# EAGLE board tc08 (EAGLE 6.6.0), part 1 of 10
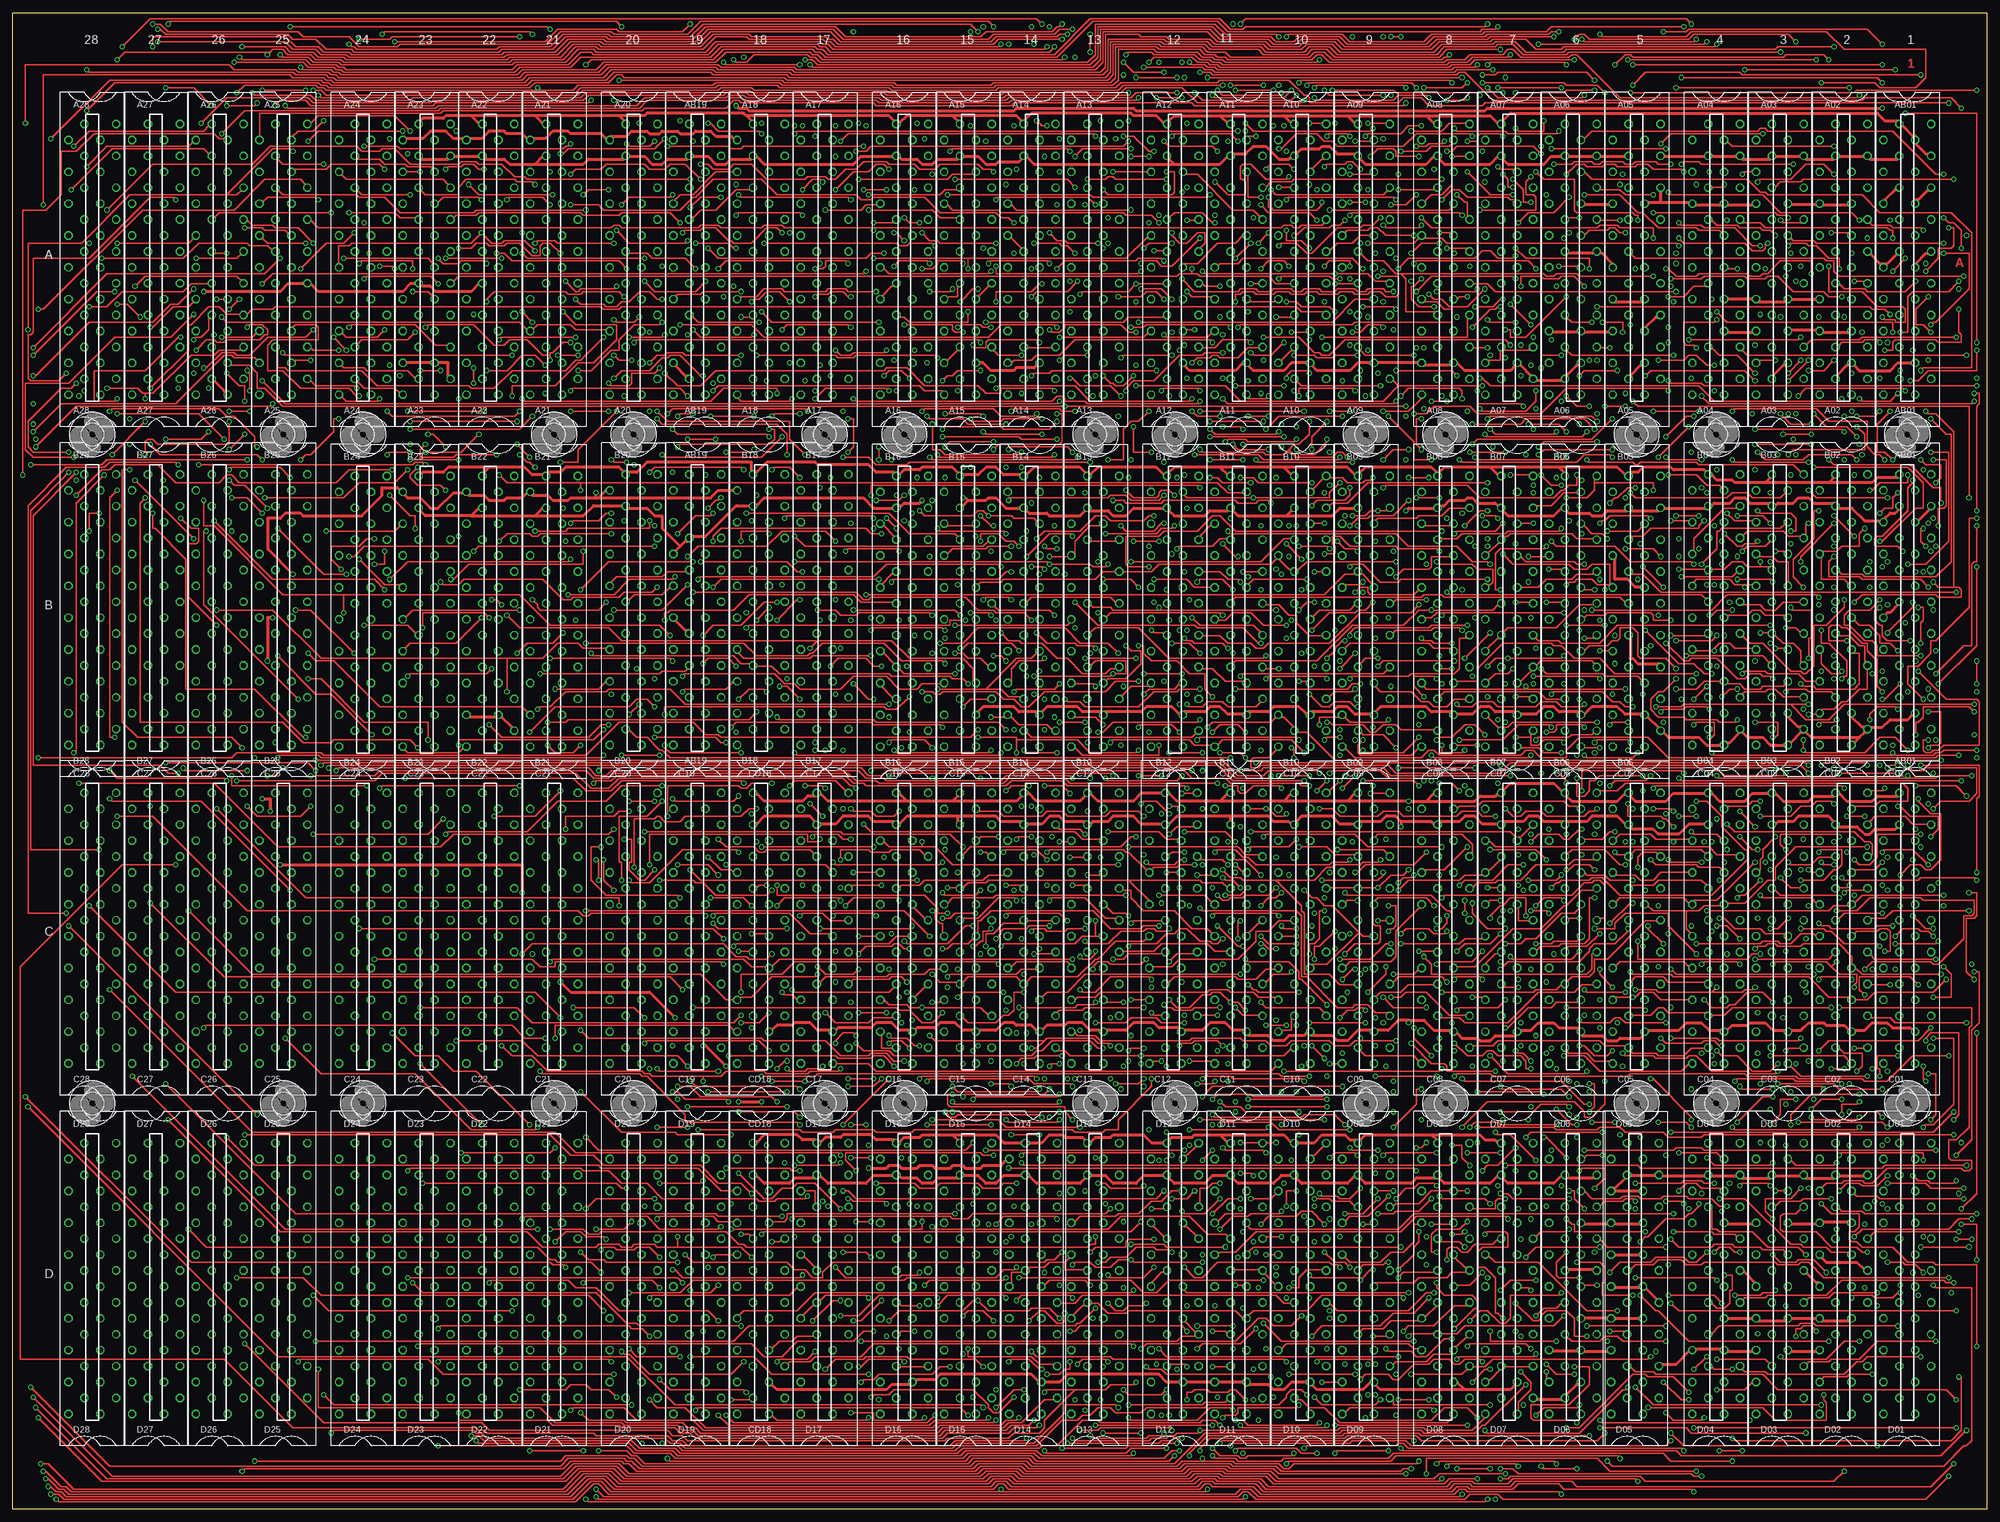
[diagram p12: board, top side]
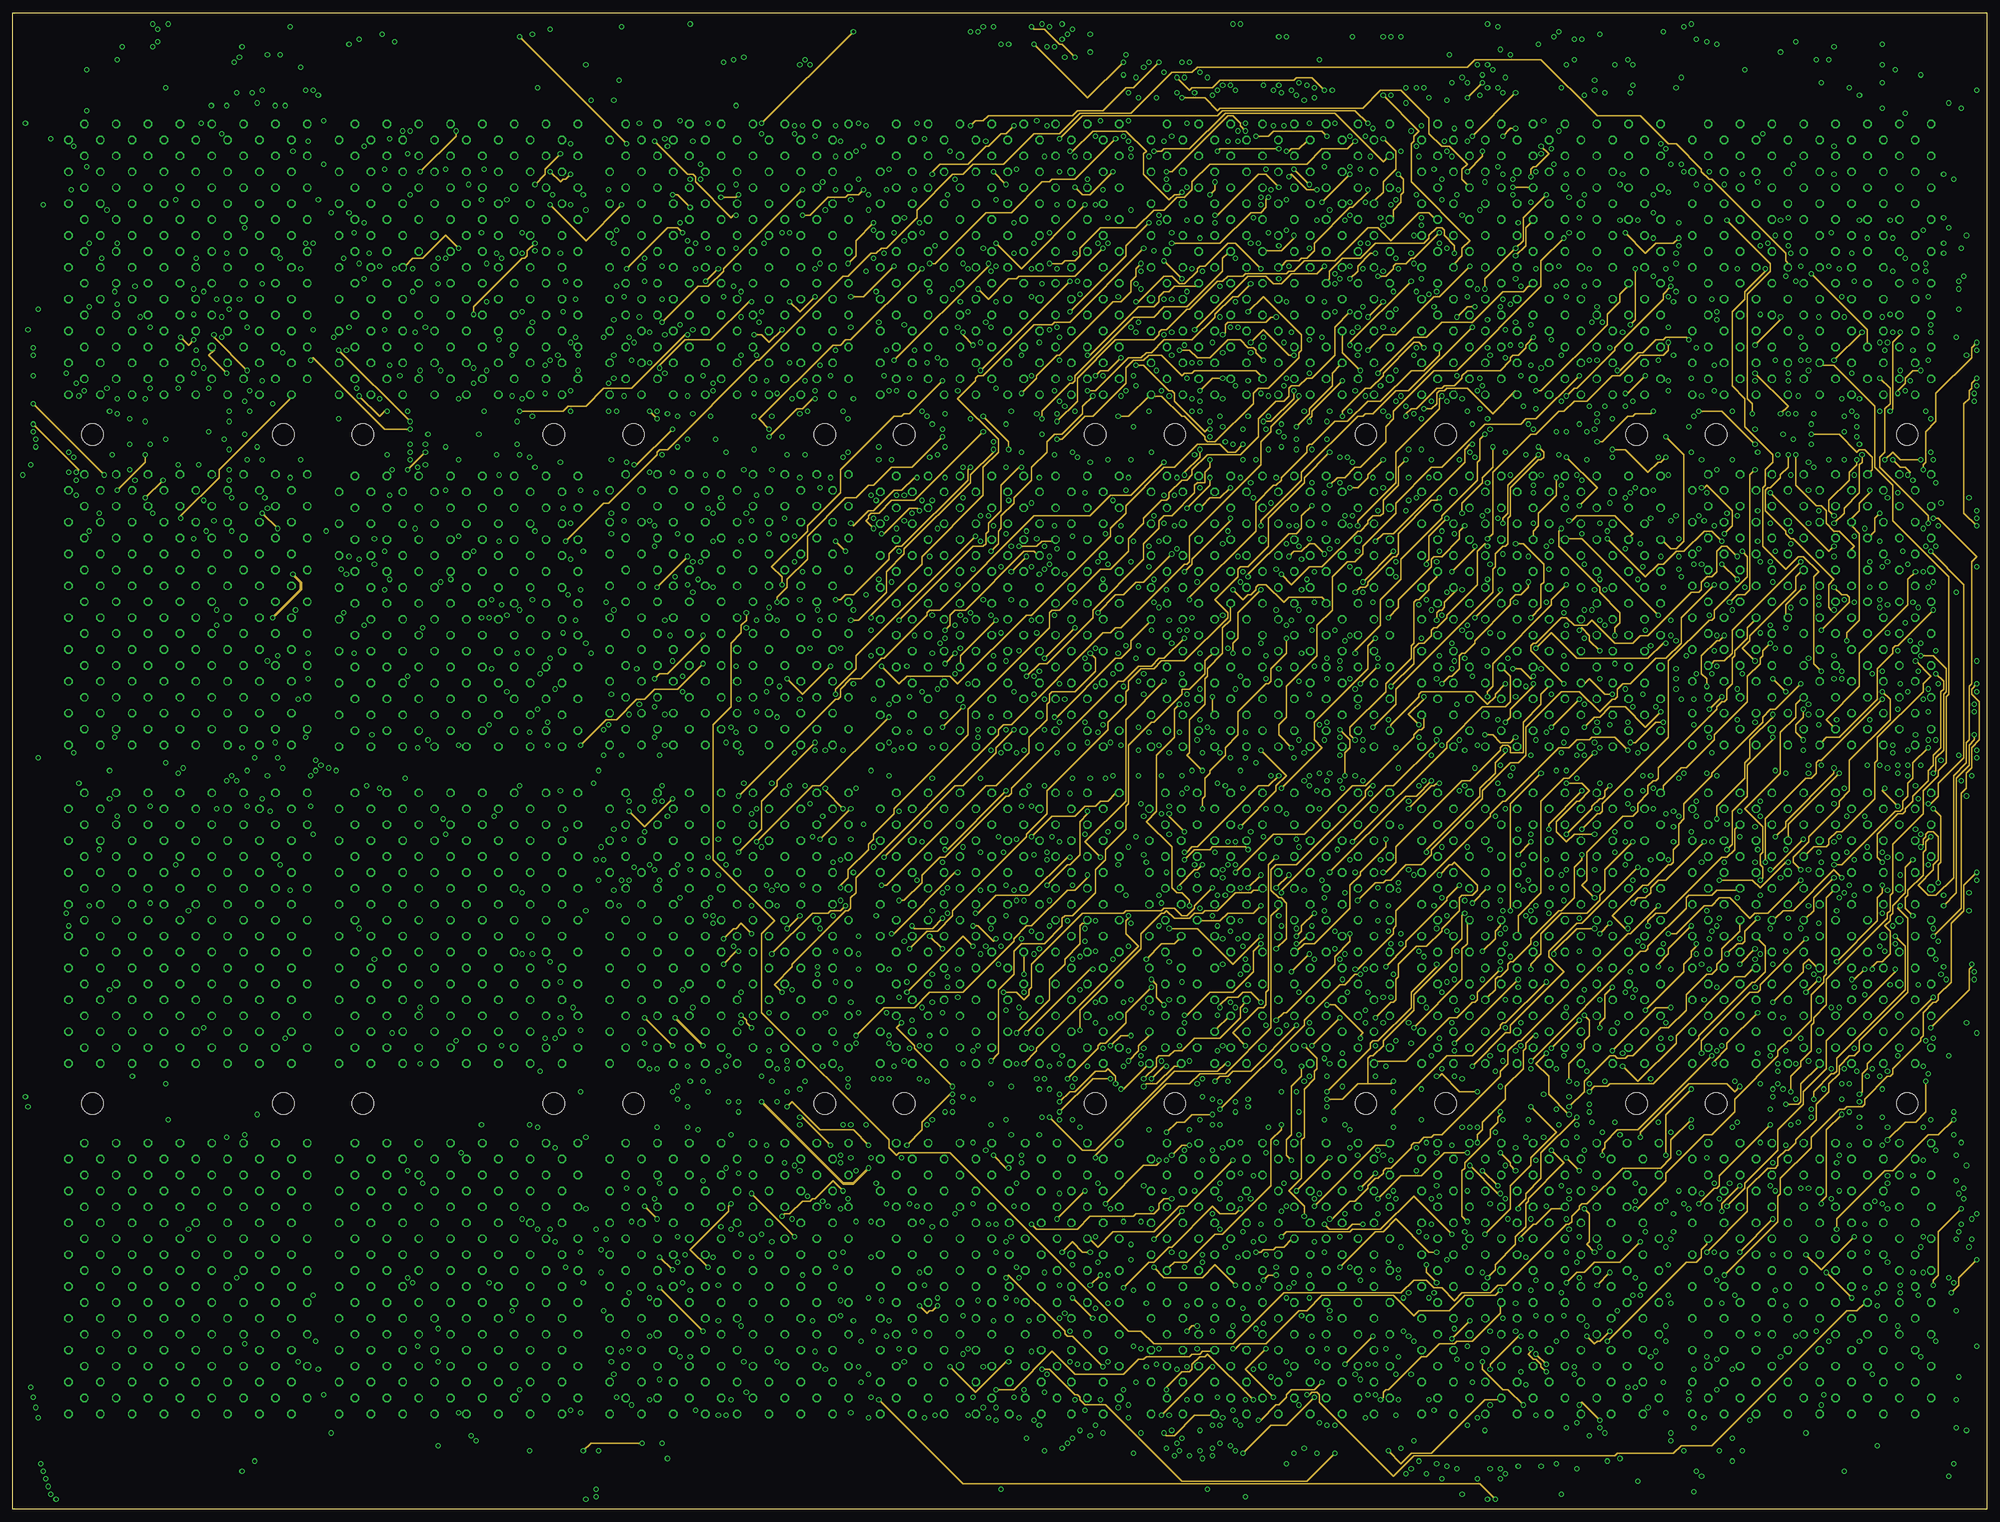
[diagram p13: board, inner layer Route2]
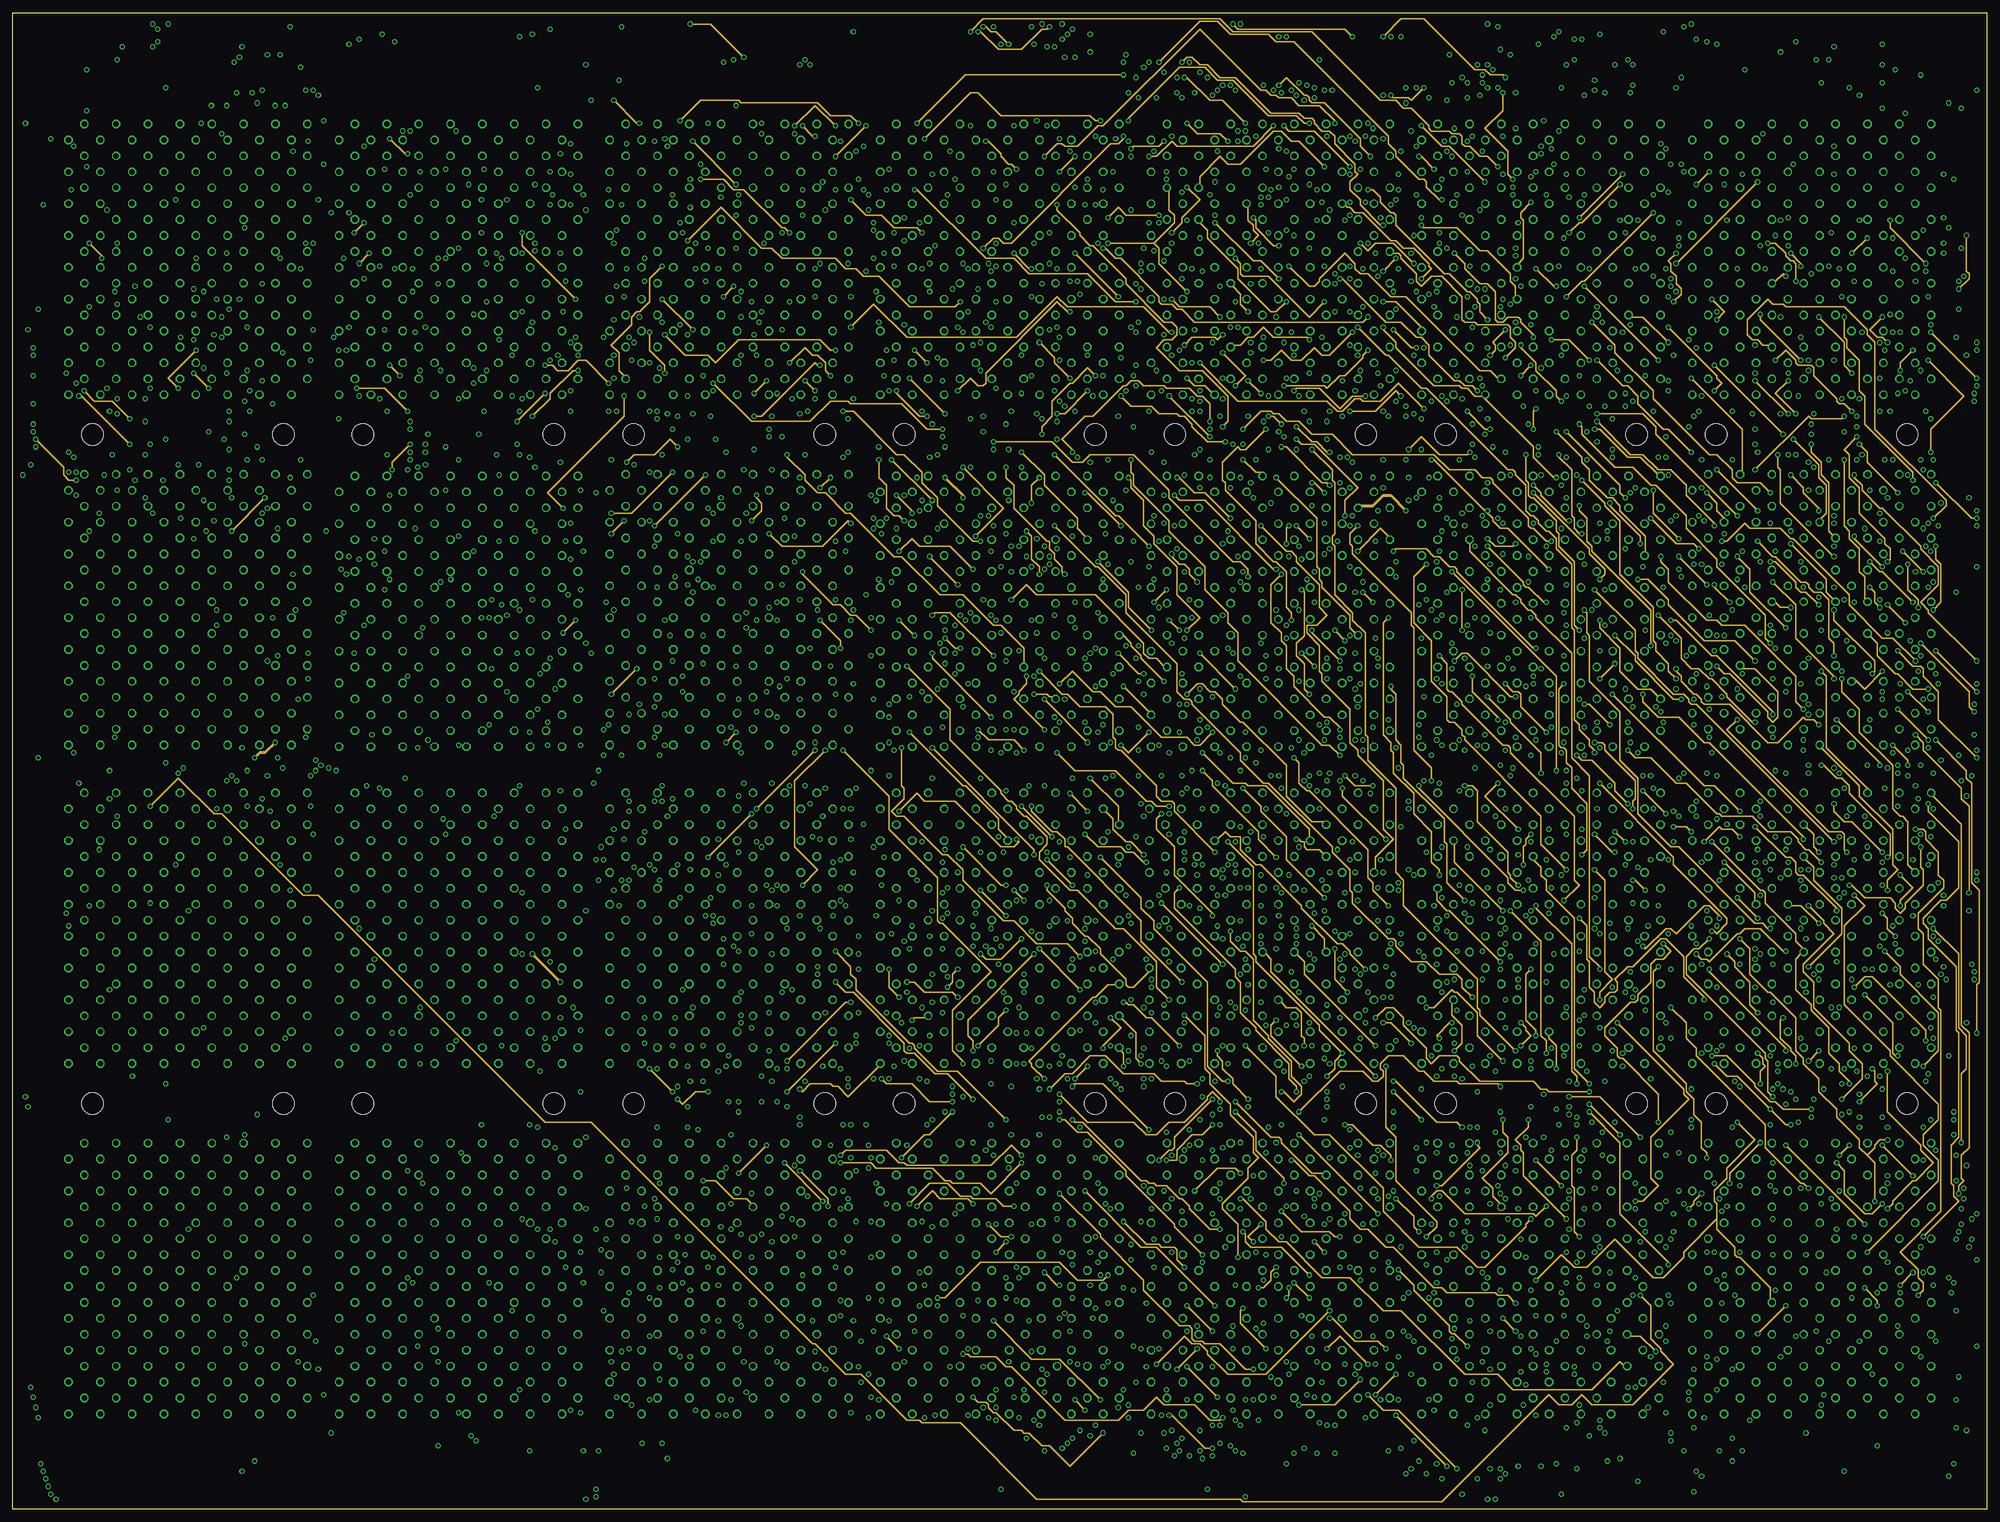
[diagram p14: board, inner layer Route15]
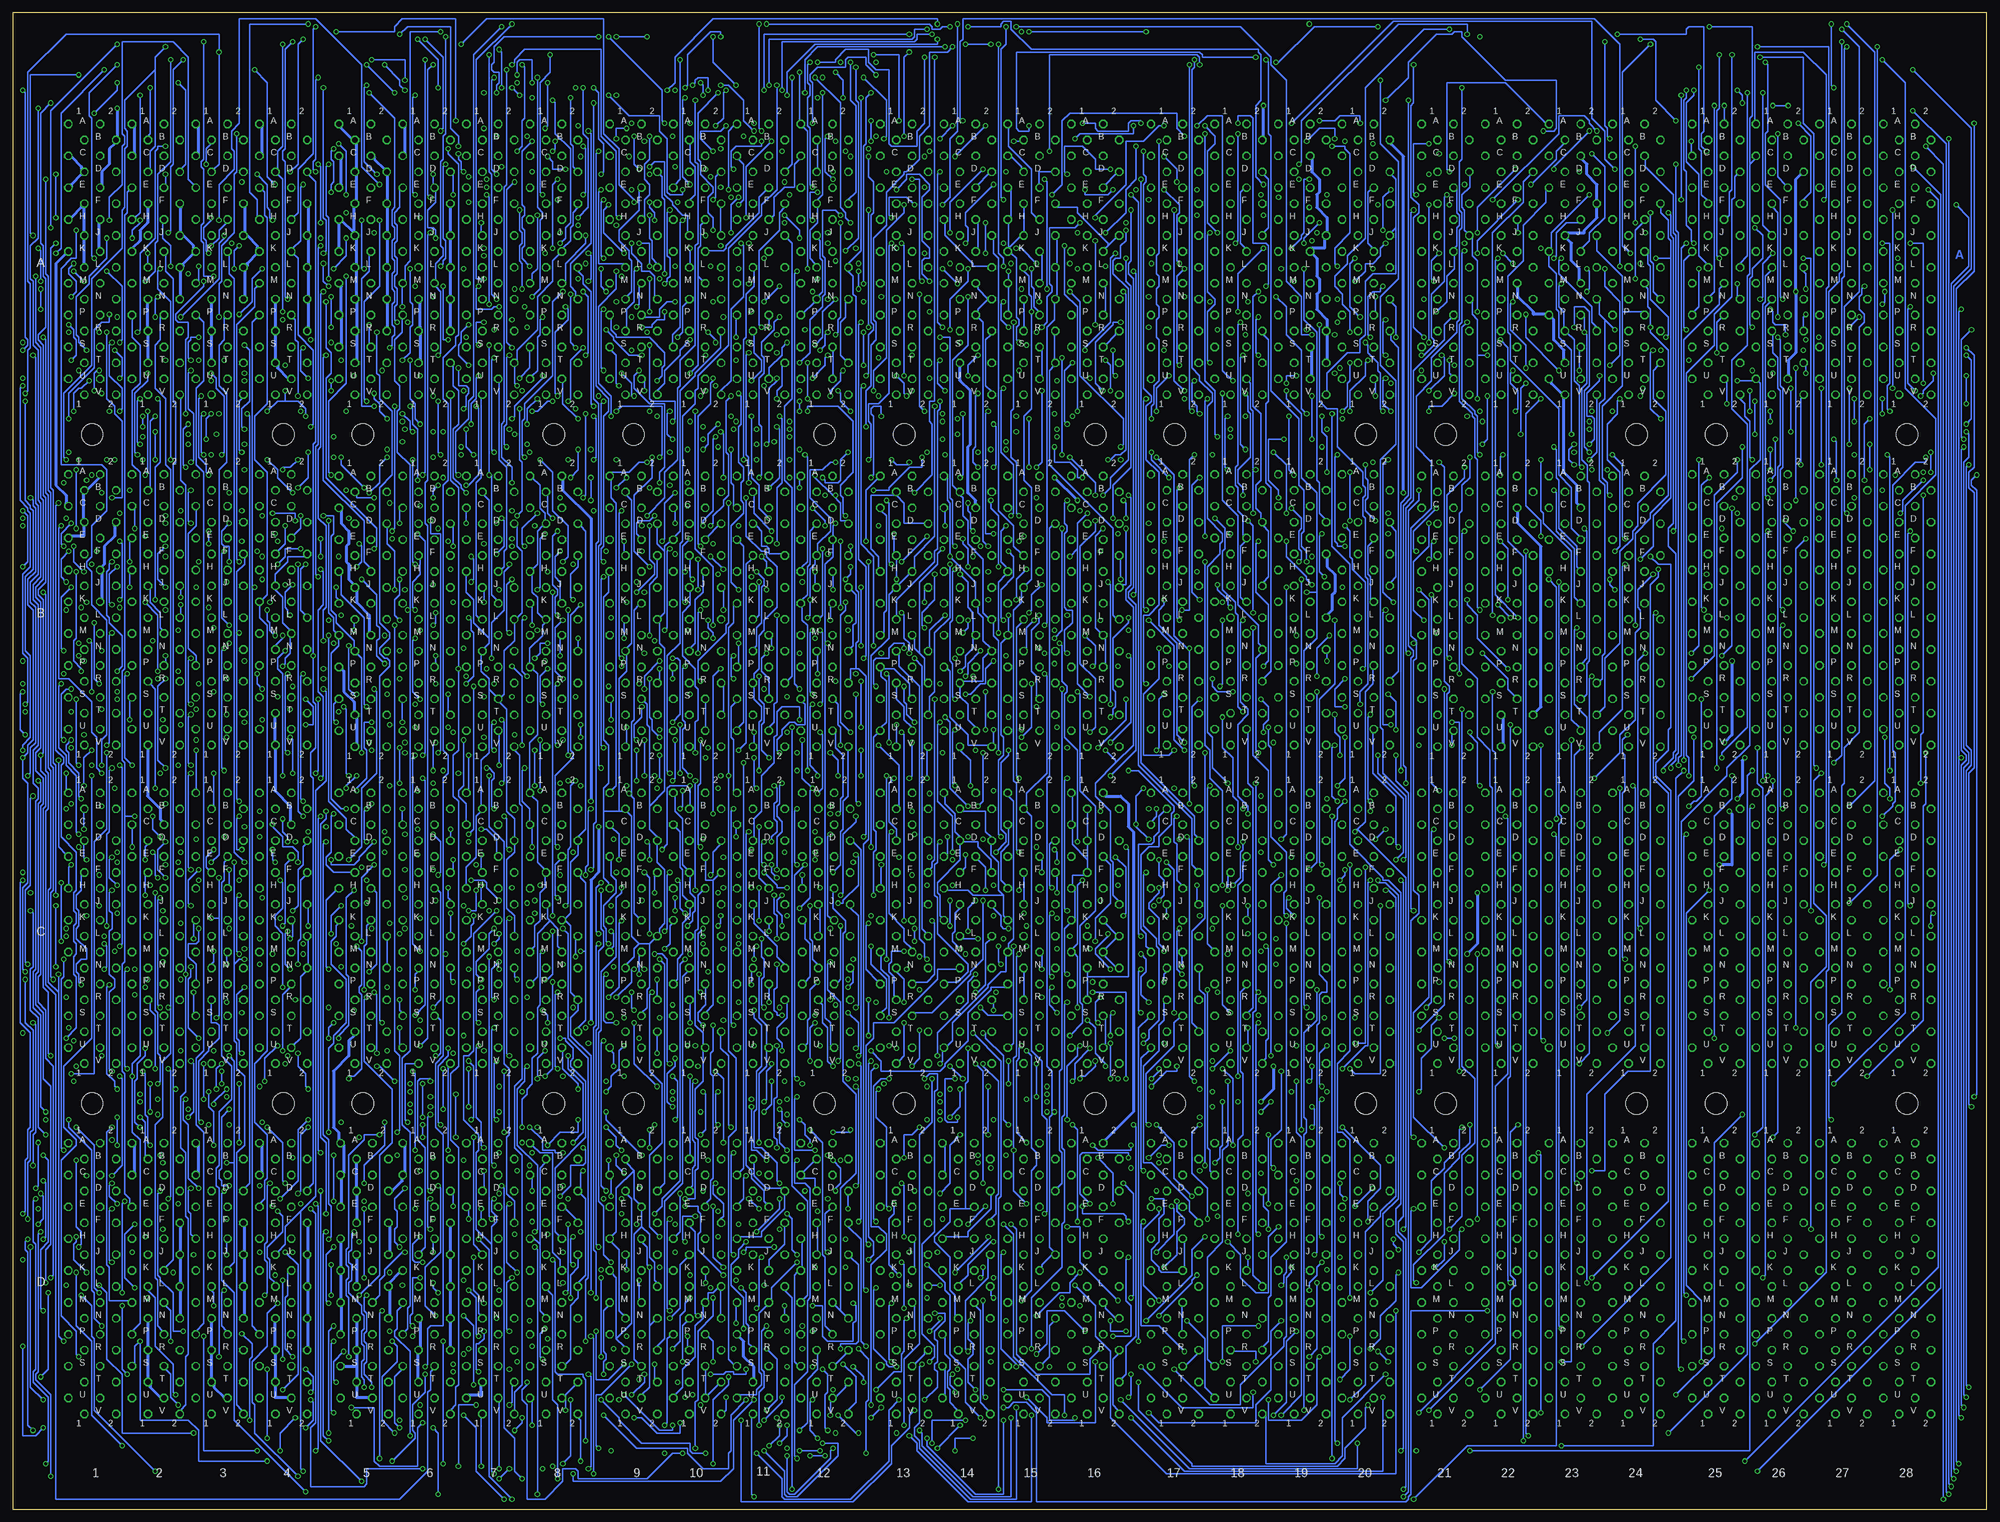
[diagram p15: board, bottom side, seen from below]

Size 393.76 x 298.44 mm. Coordinates in mm from the lower left corner, seen from the top.
Outline: 393.73,0 0,0 0.03,298.42 393.76,298.44 393.73,0
Copper layers (1*2*15*16): Top 0.035mm / dielectric 1.5mm / Route2 0.035mm / dielectric 0.15mm / Route15 0.035mm / dielectric 0.2mm / Bottom 0.035mm
Design rules "10mils": minimum track width 10mil, minimum drill 24mil, track to track 10mil, track to pad 10mil, pad to pad 10mil, via to via 10mil, smd to smd 10mil, copper to edge 40mil, drill to drill 10mil, minimum pad ring 10mil, minimum via ring 8mil, stop-mask expansion 0mil, vias tented up to drill 0mil, thermal gap 10mil
Net classes: 1 Power: width 0.635 mm, drill 0.381 mm, clearance 0.381 mm

## Footprints (pad centres in the part's own frame; a part is rotated, then mirrored left to right if it is on the bottom)
H807 = drill 1.092 octagon: A1 4.763,28.575; A2 -1.587,28.575; B1 1.587,25.4; B2 -4.763,25.4; C1 4.763,22.225; C2 -1.587,22.225; D1 1.587,19.05; D2 -4.763,19.05; E1 4.763,15.875; E2 -1.587,15.875; F1 1.587,12.7; F2 -4.763,12.7; H1 4.763,9.525; H2 -1.587,9.525; J1 1.587,6.35; J2 -4.763,6.35; K1 4.763,3.175; K2 -1.587,3.175; L1 1.587,0; L2 -4.763,0; M1 4.763,-3.175; M2 -1.587,-3.175; N1 1.587,-6.35; N2 -4.763,-6.35; P1 4.763,-9.525; P2 -1.587,-9.525; R1 1.587,-12.7; R2 -4.763,-12.7; S1 4.763,-15.875; S2 -1.587,-15.875; T1 1.587,-19.05; T2 -4.763,-19.05; U1 4.763,-22.225; U2 -1.587,-22.225; V1 1.587,-25.4; V2 -4.763,-25.4
H807-2 = drill 1.092 octagon: AA1 4.763,60.325; AA2 -1.587,60.325; AB1 1.587,57.15; AB2 -4.763,57.15; AC1 4.763,53.975; AC2 -1.587,53.975; AD1 1.587,50.8; AD2 -4.763,50.8; AE1 4.763,47.625; AE2 -1.587,47.625; AF1 1.587,44.45; AF2 -4.763,44.45; AH1 4.763,41.275; AH2 -1.587,41.275; AJ1 1.587,38.1; AJ2 -4.763,38.1; AK1 4.763,34.925; AK2 -1.587,34.925; AL1 1.587,31.75; AL2 -4.763,31.75; AM1 4.763,28.575; AM2 -1.587,28.575; AN1 1.587,25.4; AN2 -4.763,25.4; AP1 4.763,22.225; AP2 -1.587,22.225; AR1 1.587,19.05; AR2 -4.763,19.05; AS1 4.763,15.875; AS2 -1.587,15.875; AT1 1.587,12.7; AT2 -4.763,12.7; AU1 4.763,9.525; AU2 -1.587,9.525; AV1 1.587,6.35; AV2 -4.763,6.35; BA1 4.763,-9.525; BA2 -1.587,-9.525; BB1 1.587,-12.7; BB2 -4.763,-12.7; BC1 4.763,-15.875; BC2 -1.587,-15.875; BD1 1.587,-19.05; BD2 -4.763,-19.05; BE1 4.763,-22.225; BE2 -1.587,-22.225; BF1 1.587,-25.4; BF2 -4.763,-25.4; BH1 4.763,-28.575; BH2 -1.587,-28.575; BJ1 1.587,-31.75; BJ2 -4.763,-31.75; BK1 4.763,-34.925; BK2 -1.587,-34.925; BL1 1.587,-38.1; BL2 -4.763,-38.1; BM1 4.763,-41.275; BM2 -1.587,-41.275; BN1 1.587,-44.45; BN2 -4.763,-44.45; BP1 4.763,-47.625; BP2 -1.587,-47.625; BR1 1.587,-50.8; BR2 -4.763,-50.8; BS1 4.763,-53.975; BS2 -1.587,-53.975; BT1 1.587,-57.15; BT2 -4.763,-57.15; BU1 4.763,-60.325; BU2 -1.587,-60.325; BV1 1.587,-63.5; BV2 -4.763,-63.5
4,3 = hole 4.3: 0,0

## Placement (x,y rotation side)
A02  M903  [H807]  365.16,247.64 0 top
A03  M903  [H807]  352.46,247.64 0 top
A04  M903  [H807]  339.76,247.64 0 top
A05  M903  [H807]  323.89,247.64 0 top
A06  M903  [H807]  311.19,247.64 0 top
A07  M161  [H807]  298.49,247.64 0 top
A08  M206  [H807]  285.79,247.64 0 top
A09  M117  [H807]  269.91,247.64 0 top
A10  M113  [H807]  257.21,247.64 0 top
A11  M111  [H807]  244.51,247.64 0 top
A12  M113  [H807]  231.81,247.64 0 top
A13  H807  [H807]  215.94,247.64 0 top
A14  M302  [H807]  203.24,247.64 0 top
A15  M627  [H807]  190.54,247.64 0 top
A16  M602  [H807]  177.84,247.64 0 top
A17  H807  [H807]  161.96,247.64 0 top
A18  G888  [H807]  149.26,247.64 0 top
A20  G888  [H807]  123.86,247.64 0 top
A21  G888  [H807]  107.99,247.64 0 top
A22  M502  [H807]  95.29,247.64 0 top
A23  M633  [H807]  82.59,247.64 0 top
A24  W023  [H807]  69.89,247.64 0 top
A25  M916  [H807]  54.01,247.64 0 top
A26  M916  [H807]  41.31,247.64 0 top
A27  H807  [H807]  28.61,247.64 0 top
A28  H807  [H807]  15.91,247.64 0 top
AB01  G821  [H807-2]  377.86,215.89 0 top
AB19  W032  [H807-2]  136.56,215.89 0 top
B02  M623  [H807]  365.16,177.79 0 top
B03  M623  [H807]  352.46,177.79 0 top
B04  M623  [H807]  339.76,177.79 0 top
B05  M623  [H807]  323.89,177.47 0 top
B06  M111  [H807]  311.19,177.47 0 top
B07  M207  [H807]  298.49,177.47 0 top
B08  M113  [H807]  285.79,177.47 0 top
B09  M206  [H807]  269.91,177.47 0 top
B10  M627  [H807]  257.21,177.47 0 top
B11  M115  [H807]  244.51,177.47 0 top
B12  M117  [H807]  231.81,177.47 0 top
B13  M206  [H807]  215.94,177.47 0 top
B14  M206  [H807]  203.24,177.47 0 top
B15  M113  [H807]  190.54,177.47 0 top
B16  M602  [H807]  177.84,177.47 0 top
B17  H807  [H807]  161.96,177.79 0 top
B18  G888  [H807]  149.26,177.79 0 top
B20  G888  [H807]  123.86,177.79 0 top
B21  G879  [H807]  107.99,177.47 0 top
B22  M633  [H807]  95.29,177.47 0 top
B23  W005  [H807]  82.59,177.47 0 top
B24  H807  [H807]  69.89,177.47 0 top
B25  H807  [H807]  54.01,177.79 0 top
B26  H807  [H807]  41.31,177.79 0 top
B27  H807  [H807]  28.61,177.79 0 top
B28  H807  [H807]  15.91,177.79 0 top
C01  M101  [H807]  377.86,114.29 0 top
C02  M101  [H807]  365.16,114.29 0 top
C03  M101  [H807]  352.46,114.29 0 top
C04  M103  [H807]  339.76,114.29 0 top
C05  M103  [H807]  323.89,114.29 0 top
C06  M111  [H807]  311.19,114.29 0 top
C07  M207  [H807]  298.49,114.29 0 top
C08  M121  [H807]  285.79,114.29 0 top
C09  M206  [H807]  269.91,114.29 0 top
C10  M121  [H807]  257.21,114.29 0 top
C11  M113  [H807]  244.51,114.29 0 top
C12  M115  [H807]  231.49,114.29 0 top
C13  M111  [H807]  215.94,114.29 0 top
C14  M206  [H807]  203.24,114.29 0 top
C15  M113  [H807]  190.54,114.29 0 top
C16  M627  [H807]  177.84,114.29 0 top
C17  M111  [H807]  161.96,114.29 0 top
C19  H807  [H807]  136.56,114.29 0 top
C20  H807  [H807]  123.86,114.29 0 top
C21  H807  [H807]  107.99,114.29 0 top
C22  H807  [H807]  95.29,114.29 0 top
C23  H807  [H807]  82.59,114.29 0 top
C24  H807  [H807]  69.89,114.29 0 top
C25  H807  [H807]  54.01,114.29 0 top
C26  H807  [H807]  41.31,114.29 0 top
C27  H807  [H807]  28.61,114.29 0 top
C28  H807  [H807]  15.91,114.29 0 top
CD18  M228  [H807-2]  149.26,82.54 0 top
D01  H807  [H807]  377.86,44.44 0 top
D02  M903  [H807]  365.16,44.44 0 top
D03  M903  [H807]  352.46,44.44 0 top
D04  M903  [H807]  339.76,44.44 0 top
D05  M903  [H807]  323.57,44.44 0 top
D06  M903  [H807]  311.19,44.44 0 top
D07  M161  [H807]  298.49,44.44 0 top
D08  M207  [H807]  285.79,44.44 0 top
D09  M121  [H807]  269.91,44.44 0 top
D10  M119  [H807]  257.21,44.44 0 top
D11  M206  [H807]  244.51,44.44 0 top
D12  M627  [H807]  231.81,44.44 0 top
D13  M602  [H807]  215.94,44.44 0 top
D14  M307  [H807]  203.55,44.44 0 top
D15  M401  [H807]  190.54,44.44 0 top
D16  M302  [H807]  177.84,44.44 0 top
D17  M602  [H807]  161.96,44.44 0 top
D19  H807  [H807]  136.56,44.44 0 top
D20  H807  [H807]  123.86,44.44 0 top
D21  H807  [H807]  107.99,44.44 0 top
D22  H807  [H807]  95.29,44.44 0 top
D23  H807  [H807]  82.59,44.44 0 top
D24  H807  [H807]  69.89,44.44 0 top
D25  H807  [H807]  54.01,44.44 0 top
D26  H807  [H807]  41.31,44.44 0 top
D27  H807  [H807]  28.61,44.44 0 top
D28  H807  [H807]  15.91,44.44 0 top
U$17  [4,3]  54.01,214.3 0 top
U$18  [4,3]  69.89,214.3 0 top
U$19  [4,3]  107.99,214.3 0 top
U$20  [4,3]  123.86,214.3 0 top
U$66  [4,3]  161.96,214.3 0 top
U$67  [4,3]  177.84,214.3 0 top
U$68  [4,3]  215.94,214.3 0 top
U$69  [4,3]  231.81,214.3 0 top
U$70  [4,3]  269.91,214.3 0 top
U$71  [4,3]  285.79,214.3 0 top
U$72  [4,3]  323.89,214.3 0 top
U$73  [4,3]  339.76,214.3 0 top
U$74  [4,3]  377.86,214.3 0 top
U$75  [4,3]  377.86,80.95 0 top
U$76  [4,3]  339.76,80.95 0 top
U$77  [4,3]  323.89,80.95 0 top
U$78  [4,3]  285.79,80.95 0 top
U$79  [4,3]  269.91,80.95 0 top
U$80  [4,3]  231.81,80.95 0 top
U$81  [4,3]  215.94,80.95 0 top
U$82  [4,3]  177.84,80.95 0 top
U$83  [4,3]  161.96,80.95 0 top
U$84  [4,3]  107.99,80.95 0 top
U$85  [4,3]  69.89,80.95 0 top
U$86  [4,3]  123.86,80.95 0 top
U$87  [4,3]  54.01,80.95 0 top
U$88  [4,3]  15.91,80.95 0 top
U$90  [4,3]  15.91,214.3 0 top

## Tracks (layer width: path | path; a pad name or v marks a point on that pad's centre or on a via)
0_TO_DTB  (via drill 0.61)
  Top 0.254: v225.59,85.84 224.57,84.82 v220,84.82 | v208.82,81.27 208.32,80.76 188,80.76 v187.49,81.27 | v173.26,85.84 171.74,84.32 v166.66,84.32 | v161.58,88.38 161.07,87.87 158.53,87.87 158.02,87.36 154.98,87.36 v154.47,87.87 | v150.91,91.43 148.88,93.46 126.53,93.46 v126.02,92.95 | v123.99,128 123.99,137.66 128.05,137.66 128.56,138.16 129.07,138.16 130.08,137.15 133.13,137.15 134.15,138.16 145.32,138.16 146.85,139.69 v148.37,139.69 | v195.62,211.32 196.63,212.33 208.82,212.33 209.33,212.84 209.33,218.43 v208.32,218.43 | v246.92,244.34 248.96,244.34 A11.M1
  Route2 0.254: v225.59,85.84 228.13,88.38 228.13,89.9 228.64,90.41 230.67,90.41 231.68,91.43 233.21,91.43 235.75,93.97 240.83,93.97 244.89,98.03 244.89,100.06 245.91,101.08 C11.R1 | v220,84.82 220,86.35 218.48,87.87 217.97,87.36 215.94,87.36 211.87,83.3 210.86,83.3 v208.82,81.27 | v167.17,177.28 168.69,177.28 174.28,182.87 174.28,186.93 177.84,190.49 177.84,191.5 191.04,204.71 191.04,206.24 195.62,210.81 v195.62,211.32 | v214.41,223 215.94,223 222.54,229.6 225.08,229.6 226.1,230.62 227.11,230.62 229.65,233.16 235.24,233.16 239.81,237.73 239.81,238.24 243.37,241.8 244.38,241.8 v246.92,244.34
  Route15 0.254: v187.49,81.27 182.92,81.27 179.36,84.82 174.28,84.82 v173.26,85.84 | v148.37,139.69 v160.06,151.37 | v208.32,218.43 209.84,218.43 v214.41,223
  Bottom 0.254: v166.66,84.32 163.61,87.36 161.58,87.36 v161.58,88.38 | v154.47,87.87 v150.91,91.43 | v126.02,92.95 123.99,92.95 v123.99,128 | v160.06,151.37 162.09,153.4 162.09,172.2 v167.17,177.28
0_TO_EF
  Bottom 0.254: A11.E2 243.37,263.13 244.89,261.61 244.89,258.56 251.5,251.96 251.5,251.45 252,250.94 255.05,250.94 A10.K2
0_TO_STA
  Top 0.254: A11.N1 246.42,240.78 252,240.78 A10.N2
1_TO_DF  (via drill 0.61)
  Top 0.254: v238.29,4.05 237.78,3.54 197.65,3.54 | 197.65,3.54 v197.14,4.05 | v215.43,107.68 215.43,108.19 216.44,109.21 218.48,109.21 218.98,108.7 225.08,108.7 v226.1,109.72 | v288.07,262.12 289.6,260.59 290.1,260.59 290.1,257.54 A08.H1 | v286.55,290.06 286.04,289.55 285.53,289.55 285.02,289.04 263.18,289.04 261.66,290.56 259.62,290.56 258.61,289.55 242.86,289.55 241.84,290.56 238.29,290.56 237.27,291.58 229.14,291.58 228.64,292.09 219.49,292.09 219.49,285.99 218.48,284.98 154.47,284.98 153.96,285.48 121.96,285.48 121.45,285.99 120.43,285.99 118.91,284.47 104.18,284.47 103.16,283.45 63.03,283.45 62.52,283.96 61.5,283.96 61,284.47 20.36,284.47 v14.77,278.88 | v7.66,3.04 9.18,3.04 10.2,2.02 111.8,2.02 115.35,5.58 117.38,5.58 119.42,3.54 197.65,3.54
  Route2 0.254: v202.22,94.98 214.92,107.68 v215.43,107.68 | v226.1,109.72 229.14,112.76 231.68,112.76 232.7,113.78 C12.L1
  Bottom 0.254: v238.29,4.05 238.29,42.15 239.81,43.68 D11.L2 | v197.14,4.05 197.14,61.96 196.63,62.47 196.63,89.4 v202.22,94.98 | C12.J1 232.7,119.88 232.7,114.8 C12.L1 | v288.07,262.12 288.58,262.62 288.58,284.47 286.55,286.5 v286.55,290.06 | v14.77,278.88 8.16,272.28 8.16,3.54 v7.66,3.04
1_TO_DTF  (via drill 0.61)
  Top 0.254: v239.3,28.44 242.35,28.44 D11.S2 | v217.46,15.23 v225.08,15.23 | v177.84,29.45 177.33,29.96 170.72,29.96 169.2,28.44 v168.69,28.44 | v146.34,23.36 145.83,23.86 131.1,23.86 v129.07,25.9 | v127.04,34.53 125.51,36.06 123.48,36.06 122.97,36.56 85.38,36.56 v84.87,36.06 | v85.38,184.9 85.89,184.39 88.94,184.39 89.95,185.41 105.7,185.41 109.76,181.34 111.29,181.34 111.8,181.85 120.94,181.85 121.96,182.87 127.54,182.87 v128.56,183.88 | v134.66,189.98 136.69,192.01 150.4,192.01 153.45,195.06 162.09,195.06 v164.12,193.03 | v166.15,191 166.66,191.5 176.31,191.5 v176.82,191 | v193.58,181.34 194.09,181.85 198.66,181.85 v199.17,181.34
  Route2 0.254: v239.3,28.44 238.8,28.44 v229.14,18.78 | v128.56,183.88 v134.66,189.98 | v164.12,193.03 v166.15,191
  Route15 0.254: v217.46,15.23 210.86,8.62 206.79,12.69 205.27,12.69 202.73,15.23 201.71,15.23 201.2,15.74 199.68,15.74 196.12,19.29 195.62,19.29 194.6,20.31 194.6,20.82 194.09,21.32 192.57,21.32 v191.55,22.34 | v176.82,191 179.36,193.54 180.88,192.01 186.98,192.01 v191.55,187.44 | v199.17,181.34 202.22,184.39 204.25,182.36 215.94,182.36 225.59,172.71 225.59,170.68 226.6,169.66 228.13,169.66 229.65,168.14 B12.P2
  Bottom 0.254: v229.14,18.78 225.59,15.23 v225.08,15.23 | v191.55,22.34 187.49,18.28 187.49,17.26 177.84,17.26 v177.84,29.45 | v168.69,28.44 160.56,20.31 146.34,20.31 v146.34,23.36 | v129.07,25.9 127.04,27.93 v127.04,34.53 | v84.87,36.06 85.38,36.56 85.38,136.64 84.87,137.15 84.87,138.16 85.38,138.67 v85.38,184.9 | v191.55,187.44 193.58,185.41 v193.58,181.34
76  (via drill 0.61)
  Top 0.254: v309.41,90.41 313.47,90.41 316.52,87.36 332.78,87.36 334.3,88.89 C04.V2
  Bottom 0.254: v309.41,90.41 308.9,90.41 308.39,90.92 308.39,97.52 308.9,98.03 C06.S2
76+77  (via drill 0.61)
  Top 0.254: v356.65,125.46 361.22,125.46 363.26,127.5 363.76,127.5 364.78,128.51 364.78,131.56 360.72,131.56 v360.21,131.05
  Route2 0.254: v262.67,57.9 263.18,57.9 266.74,61.46 267.75,61.46 270.29,64 270.29,64.5 271.82,66.03 272.32,66.03 273.34,67.04 273.34,67.55 273.85,68.06 274.86,68.06 278.93,72.12 278.93,72.63 279.44,73.14 280.45,73.14 281.47,74.16 282.99,74.16 283.5,74.66 285.02,74.66 296.71,86.35 296.71,87.36 298.23,88.89 298.23,91.43 300.26,93.46 300.77,93.46 322.11,114.8 322.62,114.8 v328.2,120.38 | v330.24,114.8 331.76,114.8 337.35,120.38 338.87,120.38 340.4,121.91 342.43,121.91 346.49,117.84 347.51,118.86 350.05,118.86 v356.65,125.46
  Route15 0.254: v228.13,28.94 233.72,34.53 235.24,33.01 236.76,33.01 238.29,31.48 238.29,30.98 242.35,26.91 249.97,26.91 v262.67,39.61 | v360.21,131.05 359.19,132.07 359.19,134.61 357.67,136.13 C03.C1
  Bottom 0.254: v228.13,28.94 225.59,26.4 225.59,21.32 227.11,19.8 D12.V2 | v262.67,39.61 263.18,40.12 263.18,57.39 v262.67,57.9 | v328.2,120.38 330.24,118.35 v330.24,114.8
77
  Top 0.254: C06.U2 309.92,91.43 310.42,90.92 313.98,90.92 315.5,89.4 318.55,89.4 C05.V2
!00  (via drill 0.61)
  Top 0.254: v100.62,170.68 102.65,172.71 107.73,172.71 v109.76,174.74 | v111.29,196.58 111.8,197.09 116.88,197.09 118.4,198.62 v119.42,198.62 | v132.62,217.92 133.13,218.43 v135.67,218.43 | v296.2,267.7 296.71,267.2 299.76,267.2 A07.D1
  Route2 0.254: v149.39,276.34 v167.68,294.63
  Route15 0.254: v109.76,174.74 v112.3,177.28 | v119.42,198.62 123.48,198.62 v131.61,206.74 | v141.77,241.8 v143.8,243.83 | v191.04,294.63 193.58,297.17 240.83,297.17 243.37,294.63 259.12,294.63 272.83,280.91 275.88,280.91 277.4,279.39 278.93,279.39 282.48,275.83 282.48,275.32 282.99,274.82 286.55,274.82 287.06,274.31 288.58,274.31 289.09,273.8 289.09,272.28 289.6,271.77 290.61,271.77 292.64,269.74 294.17,269.74 v296.2,267.7
  Bottom 0.254: v100.62,170.68 95.54,165.6 95.54,163.56 94.02,162.04 B22.S2 | v112.3,177.28 114.34,179.31 114.34,188.96 111.29,192.01 v111.29,196.58 | v131.61,206.74 131.61,213.86 132.62,214.87 v132.62,217.92 | v135.67,218.43 136.69,219.44 136.69,231.13 139.74,234.18 139.74,239.76 v141.77,241.8 | v143.8,243.83 143.29,244.34 143.29,251.96 143.8,252.46 146.34,252.46 146.34,277.36 146.85,277.86 149.39,277.86 v149.39,276.34 | v167.68,294.63 v191.04,294.63
!0_TO_AC  (via drill 0.61)
  Top 0.254: v306.87,162.55 307.38,163.06 317.03,163.06 319.06,161.02 320.58,161.02 321.6,160.01 v323.12,160.01
  Bottom 0.254: v306.87,162.55 306.87,158.99 B06.T2 | v323.12,160.01 323.63,160.52 323.63,177.79 328.2,182.36 328.2,186.42 B05.H1
!0_TO_DTB  (via drill 0.61)
  Top 0.254: B10.L1 260.64,179.31 266.74,179.31 267.75,180.33 B09.K2 | v270.8,142.74 274.36,142.74 C09.A1 | v247.94,209.28 248.45,208.78 v267.24,208.78
  Bottom 0.254: 270.29,142.23 v270.8,142.74 | 270.29,142.23 269.78,141.72 269.78,118.86 268.77,117.84 C09.K2 | C09.A1 274.36,143.24 273.34,144.26 273.34,200.65 274.36,201.66 274.36,205.73 B09.A1 274.36,206.74 270.8,206.74 268.77,208.78 v267.24,208.78 | v247.94,209.28 247.94,233.16 247.43,233.67 247.43,242.3 245.91,243.83 245.91,246.88 A11.L1 | 270.29,142.23 270.29,156.96 269.78,157.47 269.78,179.31 268.77,180.33 B09.K2
!0_TO_EF  (via drill 0.61)
  Top 0.254: 287.06,236.72 287.06,239.26 285.53,239.26 284.01,240.78 281.47,240.78 A08.N2 | 287.06,236.72 287.06,235.7 A08.R1 | v244.38,235.7 244.89,236.21 267.24,236.21 267.75,236.72 287.06,236.72 | v278.93,274.82 285.02,274.82 286.55,276.34 290.1,276.34 A08.A1
  Bottom 0.254: v244.38,235.7 244.89,236.21 244.89,250.94 240.83,255 240.83,258.56 239.81,259.58 A11.F2 | v278.93,274.82 278.42,274.31 278.42,252.46 282.48,248.4 282.48,243.83 281.47,242.81 281.47,241.8 A08.N2
!0_TO_LPB  (via drill 0.61)
  Top 0.254: v228.64,31.99 230.16,30.47 v276.39,30.47 | v276.39,46.22 277.4,47.23 283.5,47.23 D08.K2
  Bottom 0.254: v228.64,31.99 228.64,33.01 225.59,33.01 225.08,33.52 225.08,48.76 226.6,50.28 D12.J2 | v276.39,30.47 v276.39,46.22 | D08.A1 290.1,72.63 288.58,71.11 286.04,71.11 286.04,51.3 284.52,49.77 284.52,48.25 D08.K2
!0_TO_STA  (via drill 0.61)
  Top 0.254: B11.P2 243.37,168.64 243.88,169.15 260.13,169.15 267.24,176.26 277.4,176.26 280.45,179.31 v282.99,179.31 295.18,179.31 296.2,180.33 B07.K2 | v302.8,150.36 302.3,149.85 283.5,149.85 v282.99,150.36 | v298.74,206.24 302.8,206.24 B07.A1 | v249.46,233.67 256.58,233.67 259.62,230.62 260.64,230.62 261.15,230.11 262.67,230.11 265.72,233.16 297.72,233.16 v298.74,232.14
  Bottom 0.254: v302.8,150.36 302.8,143.24 C07.A1 | v282.99,179.31 v282.99,150.36 | B07.K2 297.22,181.34 298.23,182.36 298.23,206.24 v298.74,206.24 v298.74,232.14 | v249.46,233.67 249.46,237.73 A11.P1
!0_TO_STATE  (via drill 0.61)
  Top 0.254: v143.8,112.26 144.31,112.76 174.79,112.76 176.31,114.29 C16.L1
  Bottom 0.254: v143.8,112.26 143.29,111.75 143.29,93.97 143.8,93.46 143.8,89.9 144.31,89.4 CD18.AV2
!0_TO_W  (via drill 0.61)
  Top 0.254: v145.32,54.85 146.85,54.85 147.36,54.34 CD18.BH2 | v145.32,97.02 148.88,97.02 v150.91,99.05 | v152.44,120.38 153.96,121.91 164.63,121.91 v165.14,121.4 | v165.14,129.53 165.14,131.56 170.72,131.56 171.23,131.05 174.79,131.05 175.3,131.56 180.88,131.56 181.9,130.54 C16.E1
  Bottom 0.254: v145.32,54.85 145.83,55.36 145.83,96.51 v145.32,97.02 | v150.91,99.05 152.44,100.57 v152.44,120.38 | v165.14,121.4 164.12,122.42 164.12,125.46 165.14,126.48 v165.14,129.53
!01  (via drill 0.61)
  Top 0.254: v79.79,242.81 82.84,242.81 83.86,241.8 A23.N1 | v79.79,247.38 79.79,248.91 69.63,248.91 v69.12,248.4 | v67.09,292.09 67.6,291.58 68.11,291.58 68.62,291.07 96.56,291.07 97.06,291.58 107.22,291.58 109.76,294.12 118.91,294.12 119.42,293.61 135.16,293.61 137.7,296.15 191.04,296.15 v192.57,294.63 | v297.22,266.18 298.23,265.16 298.23,263.64 v299.25,263.64
  Route2 0.254: v299.25,263.64 302.8,263.64 A07.E1
  Route15 0.254: v71.16,250.43 v69.12,248.4 | v192.57,294.63 193.08,294.63 196.63,291.07 201.2,291.07 205.27,295.14 206.28,295.14 v206.79,295.64 | v243.37,296.15 244.38,295.14 265.72,295.14 v267.24,293.61 | v273.34,293.61 276.9,297.17 281.47,297.17 291.63,287.01 293.66,287.01 294.68,285.99 297.22,285.99 v297.72,285.48
  Bottom 0.254: v79.79,242.81 79.28,243.32 79.28,246.88 v79.79,247.38 | v71.16,250.43 72.68,251.96 72.68,286.5 v67.09,292.09 | v206.79,295.64 208.32,295.64 208.82,295.14 210.35,295.14 210.35,295.64 210.86,296.15 v243.37,296.15 | v267.24,293.61 v273.34,293.61 | v297.72,285.48 298.23,284.98 298.23,267.2 v297.22,266.18
!02  (via drill 0.61)
  Top 0.254: v300.26,256.53 302.3,258.56 307.38,258.56 v310.42,261.61 | v309.92,288.02 309.41,288.53 294.68,288.53 v294.17,288.02 | v272.83,257.54 271.31,256.02 269.28,256.02 268.77,255.51 264.2,255.51 259.12,250.43 258.1,250.43 256.07,252.46 253.02,252.46 v252.51,251.96 | v81.32,266.69 A23.D2
  Route2 0.254: v88.43,274.82 88.43,273.8 v81.32,266.69
  Route15 0.254: v252.51,251.96 251.5,251.96 247.94,255.51 247.94,257.04 v247.43,257.54 | v242.35,272.78 240.83,274.31 236.26,274.31 v234.22,276.34 | v221.52,285.99 190.03,285.99 v180.38,276.34 | v168.69,276.34 167.17,277.86 163.1,277.86 160.56,280.4 145.32,280.4 144.82,280.91 137.2,280.91 v133.13,276.85 | v125,276.34 124.5,276.34 v119.92,280.91
  Bottom 0.254: v300.26,256.53 300.26,254.5 A07.J1 | v310.42,261.61 310.93,262.12 310.93,287.01 v309.92,288.02 | v294.17,288.02 293.66,288.53 293.66,289.04 291.63,291.07 276.39,291.07 276.39,273.8 273.34,270.75 273.34,258.05 v272.83,257.54 | v247.43,257.54 247.43,267.7 v242.35,272.78 | v234.22,276.34 234.22,284.47 234.73,284.98 234.73,285.99 233.21,287.52 227.62,287.52 227.62,289.04 227.11,289.55 223.56,289.55 223.56,288.02 v221.52,285.99 | v180.38,276.34 177.84,276.34 177.84,275.32 177.33,274.82 171.23,274.82 171.23,276.34 170.72,276.85 168.69,276.85 v168.69,276.34 | v133.13,276.85 130.08,276.85 129.07,277.86 125,277.86 v125,276.34 | v119.92,280.91 115.35,285.48 115.35,288.53 109.76,294.12 106.72,294.12 106.21,294.63 104.68,294.63 104.68,293.61 96.05,284.98 85.89,284.98 85.89,275.32 86.4,274.82 v88.43,274.82
!03  (via drill 0.61)
  Top 0.254: v280.96,256.02 280.45,255.51 273.85,255.51 v273.34,256.02 | v130.08,273.29 128.05,271.26 110.78,271.26 109.76,270.24 v109.26,270.24 | v104.18,264.15 103.67,264.66 100.62,264.66 100.11,265.16 90.46,265.16 88.94,263.64 88.94,262.12 82.33,262.12 81.32,263.13 A23.E2
  Route2 0.254: v211.87,289.55 209.33,292.09 208.82,292.09 205.78,295.14 203.74,295.14 v203.24,295.64 | v109.26,270.24 106.21,267.2 106.21,266.18 v104.18,264.15
  Route15 0.254: v280.96,256.02 281.47,255.51 288.07,255.51 292.64,250.94 294.17,250.94 298.74,246.37 298.74,244.84 299.76,243.83 299.76,241.8 A07.N1 | v273.34,256.02 272.83,256.02 268.77,260.08 268.77,261.1 266.74,263.13 266.74,264.66 268.26,266.18 267.75,266.69 267.75,268.21 263.69,272.28 263.69,273.8 262.67,274.82 261.15,274.82 259.62,276.34 259.62,276.85 259.12,277.36 257.59,277.36 256.58,278.37 250.99,278.37 243.88,285.48 240.83,285.48 238.29,288.02 236.76,288.02 235.24,289.55 234.22,289.55 v233.21,288.53 | v144.31,264.15 v135.67,272.78
  Bottom 0.254: v233.21,288.53 229.65,288.53 229.65,289.04 227.62,291.07 223.05,291.07 223.05,288.53 221.52,287.01 218.98,287.01 218.98,272.28 218.48,271.77 213.4,271.77 213.4,274.82 211.87,276.34 v211.87,289.55 | v203.24,295.64 196.63,295.64 196.63,296.15 196.12,296.66 194.6,296.66 194.6,295.14 190.54,291.07 145.32,291.07 145.32,290.56 144.82,290.06 144.82,280.91 145.83,279.9 145.83,265.67 v144.31,264.15 | v135.67,272.78 133.13,275.32 130.08,275.32 v130.08,273.29
!04  (via drill 0.61)
  Top 0.254: v76.24,292.6 106.21,292.6 108.75,295.14 120.43,295.14 120.94,294.63 133.64,294.63 v135.16,296.15 | v285.02,261.1 287.06,263.13 288.58,263.13 290.1,261.61 298.23,261.61 298.74,261.1 299.76,261.1 A07.F1
  Route2 0.254: v191.04,275.83 192.06,276.85 193.58,276.85 194.6,277.86 211.36,277.86 212.38,278.88 217.46,278.88 222.03,283.45 223.56,283.45 v228.64,288.53
  Route15 0.254: v78.78,270.24 78.27,270.24 v75.22,273.29 | v135.16,296.15 139.23,296.15 v145.83,289.55 | v228.64,288.53 236.76,296.66 240.32,296.66 242.86,294.12 250.48,294.12 252,292.6 255.56,292.6 274.36,273.8 274.36,272.28 275.88,270.75 275.88,269.74 280.45,265.16 281.47,265.16 281.98,264.66 281.98,263.64 284.52,261.1 v285.02,261.1
  Bottom 0.254: v78.78,270.24 76.24,267.7 76.24,257.54 79.28,254.5 79.28,252.97 80.81,251.45 A23.K2 | v75.22,273.29 75.73,273.8 75.73,275.32 76.24,275.83 v76.24,292.6 | v145.83,289.55 156.5,289.55 156.5,290.06 157.01,290.56 193.58,290.56 193.58,275.32 193.08,274.82 191.04,274.82 v191.04,275.83
!05  (via drill 0.61)
  Top 0.254: v249.46,216.9 v238.8,216.9 | v211.36,210.81 210.35,211.82 199.17,211.82 v198.66,211.32 | v193.58,217.92 193.08,218.43 v185.96,218.43 | v178.85,225.54 177.33,227.06 174.79,227.06 v173.77,226.05 | v174.28,231.13 173.77,230.62 167.68,230.62 167.17,230.11 165.14,230.11 v164.12,231.13 | v130.08,234.18 129.58,233.67 v122.97,233.67 | v120.43,243.83 119.92,243.32 113.32,243.32 112.81,242.81 112.3,242.81 v110.27,244.84 | v109.26,250.43 107.22,252.46 105.7,252.46 105.19,251.96 105.19,249.92 103.67,249.92 101.13,252.46 98.59,252.46 98.08,251.96 95.03,251.96 94.52,252.46 92.49,252.46 91.48,251.45 v88.94,251.45
  Route2 0.254: v272.32,226.56 279.44,233.67 281.98,233.67 285.02,236.72 291.12,236.72 297.22,242.81 301.28,242.81 302.3,243.83 302.8,243.83 A07.M1 | v255.56,223 255.56,221.48 250.99,216.9 v249.46,216.9 | v198.66,211.32 198.66,212.84 v193.58,217.92 | v88.94,251.45 86.4,253.99 81.82,249.42 79.79,249.42 78.27,247.89 A23.L2
  Route15 0.254: v269.78,221.98 267.24,221.98 264.7,219.44 260.64,223.51 256.07,223.51 v255.56,223 | v238.8,216.9 238.8,220.46 237.27,221.98 236.26,221.98 234.73,223.51 230.16,223.51 229.65,224.02 225.59,224.02 224.57,225.03 223.05,225.03 222.03,224.02 221.52,224.02 215.43,217.92 213.9,217.92 209.33,213.35 211.36,211.32 v211.36,210.81 | v185.96,218.43 v178.85,225.54 | v164.12,231.13 163.1,231.13 161.07,233.16 144.82,233.16 140.24,228.59 138.72,230.11 134.15,230.11 v130.08,234.18
  Bottom 0.254: v272.32,226.56 270.29,224.52 270.29,221.98 v269.78,221.98 | v173.77,226.05 174.28,226.56 v174.28,231.13 | v122.97,233.67 123.48,234.18 123.48,241.8 122.46,242.81 120.94,242.81 120.94,243.32 v120.43,243.83 | v110.27,244.84 110.78,245.35 110.78,248.91 v109.26,250.43
!06  (via drill 0.61)
  Top 0.254: v84.87,249.42 85.89,248.4 88.94,248.4 89.44,248.91 94.02,248.91 v94.52,248.4 | v96.56,250.43 98.08,250.43 99.6,248.91 120.94,248.91 v122.46,247.38 | v133.64,254.5 134.15,255 137.2,255 137.7,255.51 140.24,255.51 142.78,252.97 143.29,252.97 143.8,252.46 147.36,252.46 150.4,255.51 152.44,255.51 v153.45,254.5 | v177.84,257.54 178.85,256.53 v180.88,256.53 | v188.5,235.7 189.01,236.21 193.08,236.21 193.58,235.7 v195.11,235.7 | v196.12,240.78 196.12,242.81 203.24,242.81 204.76,244.34 v205.27,244.34 | v208.32,247.38 209.84,248.91 224.06,248.91 224.57,249.42 229.14,249.42 v229.65,248.91 | v233.21,245.35 235.75,242.81 244.38,242.81 244.89,243.32 247.94,243.32 248.45,242.81 250.99,242.81 251.5,243.32 255.05,243.32 255.56,242.81 257.08,242.81 257.59,243.32 260.64,243.32 261.15,242.81 263.69,242.81 264.2,243.32 267.75,243.32 268.26,242.81 269.78,242.81 270.29,243.32 273.34,243.32 273.85,242.81 v275.37,242.81 | v276.39,247.38 278.42,249.42 291.63,249.42 293.15,250.94 294.68,250.94 296.2,249.42 299.25,249.42 v299.76,249.92
  Route2 0.254: v122.46,247.38 130.59,255.51 132.62,255.51 v133.64,254.5 | v233.21,245.35 v229.65,248.91 | v299.76,249.92 301.79,251.96 301.79,255.51 302.8,256.53 A07.H1
  Route15 0.254: v155.99,275.83 160.06,279.9 v164.12,275.83
  Bottom 0.254: v84.87,249.42 85.38,248.91 85.38,246.37 78.78,239.76 78.78,236.72 77.76,235.7 A23.R2 | v96.56,250.43 v94.52,248.4 | v153.45,254.5 155.48,256.53 155.48,270.75 153.96,272.28 153.96,273.8 v155.99,275.83 | v164.12,275.83 165.14,275.83 168.18,272.78 171.74,272.78 171.74,264.15 177.84,258.05 v177.84,257.54 | v180.88,256.53 181.9,255.51 186.98,255.51 186.98,244.34 186.47,243.83 186.47,242.81 187.49,241.8 187.49,236.72 v188.5,235.7 | v195.11,235.7 196.63,237.22 196.63,240.27 v196.12,240.78 | v208.32,247.38 v205.27,244.34 | v275.37,242.81 276.39,243.83 v276.39,247.38
!07  (via drill 0.61)
  Top 0.254: v85.38,227.06 v81.32,227.06 | v104.18,252.46 104.68,252.97 108.24,252.97 108.75,252.46 v119.92,252.46 | v126.02,244.84 128.05,242.81 136.18,242.81 v138.21,244.84 | v140.75,247.38 142.28,248.91 160.56,248.91 v161.07,248.4 | v164.12,263.13 167.68,266.69 170.72,266.69 172.25,268.21 173.77,268.21 v174.79,267.2 | v274.86,293.61 v276.9,293.61 | v299.25,265.16 301.28,263.13 301.28,260.59 v302.8,260.59
  Route2 0.254: v91.98,238.24 91.98,239.76 101.64,249.42 102.14,249.42 102.65,249.92 102.65,250.94 v104.18,252.46 | v140.75,247.38 v138.21,244.84 | v183.42,266.18 183.42,266.69 184.95,268.21 190.54,268.21 194.09,271.77 194.6,271.77 197.14,274.31 198.16,274.31 v199.68,275.83
  Route15 0.254: v205.78,269.74 208.32,272.28 209.33,272.28 209.84,271.77 212.38,271.77 216.44,275.83 217.46,275.83 236.76,295.14 248.96,282.94 249.97,282.94 250.99,281.93 252,281.93 252.51,281.42 255.05,281.42 256.58,279.9 260.64,279.9 263.69,276.85 v263.69,276.34 | v297.22,282.44 297.22,278.88 293.66,275.32 298.23,270.75 298.23,266.18 v299.25,265.16 | v302.8,260.59 300.77,258.56 300.77,257.54 301.28,257.04 301.28,249.42 300.26,248.4 A07.L1
  Bottom 0.254: v81.32,227.06 81.32,231.13 A23.S2 | v85.38,227.06 91.98,233.67 v91.98,238.24 | v119.92,252.46 120.94,251.45 120.94,249.92 122.46,248.4 123.99,248.4 123.99,246.88 v126.02,244.84 | v161.07,248.4 161.58,248.91 161.58,258.05 161.07,258.56 161.07,260.08 v164.12,263.13 | v174.79,267.2 177.84,267.2 177.84,269.23 180.38,271.77 183.93,271.77 183.93,266.69 v183.42,266.18 | v205.78,269.74 v199.68,275.83 | v263.69,276.34 264.2,276.85 264.2,282.94 v274.86,293.61 | v276.9,293.61 295.69,293.61 297.72,291.58 297.72,288.53 298.23,288.02 298.23,287.01 297.72,286.5 296.71,286.5 296.71,284.47 297.22,283.96 v297.22,282.44
!76  (via drill 0.61)
  Top 0.254: v307.88,79.74 310.93,76.7 v311.95,76.7 | v311.95,49.26 316.52,49.26 317.54,48.25 317.54,45.2 317.03,45.2 317.03,42.66 v323.12,42.66 | v322.11,24.37 321.6,23.86 321.09,23.86 312.46,15.23 294.17,15.23 v293.66,15.74 | v292.14,18.28 290.1,20.31 285.53,20.31 282.99,17.77 270.29,17.77 v269.78,18.28 | v260.64,17.26 260.13,16.75 246.42,16.75 245.4,17.77 v243.88,17.77 | v234.22,28.44 233.72,28.94 230.67,28.94 D12.S2
  Route15 0.254: v307.88,87.87 307.88,92.44 306.36,93.97 306.36,94.48 C06.T2 | v311.95,74.16 311.95,71.62 310.93,70.6 310.93,64.5 311.44,64 311.44,55.36 v312.46,54.34 | v234.22,28.44 v240.32,22.34
  Bottom 0.254: D12.S2 229.65,28.94 227.62,30.98 227.62,31.48 D12.R2 | v307.88,79.74 v307.88,87.87 | v311.95,74.16 v311.95,76.7 | v312.46,54.34 313.98,52.82 313.98,49.77 313.47,49.26 v311.95,49.26 | v323.12,42.66 323.63,42.15 323.63,39.61 323.12,39.1 323.12,35.55 323.63,35.04 323.63,33.52 323.12,33.01 323.12,29.45 323.63,28.94 323.63,26.91 322.11,25.39 v322.11,24.37 | v293.66,15.74 292.14,17.26 v292.14,18.28 | v269.78,18.28 268.26,18.28 265.21,15.23 260.64,15.23 v260.64,17.26 | v243.88,17.77 240.32,21.32 v240.32,22.34
!77  (via drill 0.61)
  Top 0.254: v294.68,35.55 294.68,33.52 v307.88,33.52 | v307.88,9.13 307.38,9.64 284.52,9.64 v284.01,9.13 | v276.39,21.83 v282.48,21.83 | v255.56,11.16 255.05,10.66 246.42,10.66 245.91,10.15 244.89,10.15 244.38,10.66 240.83,10.66 v239.3,12.18
  Route2 0.254: v306.87,71.62 309.41,69.08 302.3,61.96 302.3,61.46 301.79,60.95 301.79,56.38 299.76,54.34 299.76,52.82 295.69,48.76 295.69,47.74 v294.17,46.22
  Route15 0.254: v239.3,12.18 237.78,12.18 231.18,18.78 v230.67,18.78
  Bottom 0.254: D12.T2 227.62,24.88 227.62,24.37 229.65,22.34 D12.U2 230.67,21.83 v230.67,18.78 | v306.87,71.62 306.87,88.38 C06.V2 | v294.17,46.22 295.18,45.2 295.18,36.06 v294.68,35.55 | v307.88,9.13 v307.88,33.52 | v284.01,9.13 282.48,10.66 v282.48,21.83 | v276.39,21.83 272.83,18.28 272.83,17.77 268.26,13.2 258.61,13.2 258.61,11.67 258.1,11.16 v255.56,11.16
!ADDR_ACC  (via drill 0.61)
  Top 0.254: v178.34,105.14 177.33,106.16 175.3,106.16 174.79,105.65 167.68,105.65 167.17,105.14 C17.P1 | v188.5,102.1 189.52,103.11 v197.65,103.11
  Route2 0.254: v197.65,103.11 200.19,103.11 201.71,101.59 202.73,102.6 202.73,103.62 203.24,104.13 203.24,108.7 213.4,118.86 221.52,118.86 222.03,119.37 229.14,119.37 229.65,119.88 231.68,119.88 233.21,118.35 234.22,118.35 235.75,119.88 235.75,120.38 v239.3,123.94 | v243.88,126.99 251.5,134.61 257.59,134.61 267.24,144.26 269.78,144.26 279.44,153.91 279.44,154.42 280.45,155.44 280.96,155.44 281.47,155.94 281.47,157.98 B08.T2
  Route15 0.254: v178.34,105.14 179.87,105.14 181.9,103.11 187.49,103.11 v188.5,102.1
  Bottom 0.254: v239.3,123.94 241.34,123.94 241.34,124.45 v243.88,126.99
!B-BRK  (via drill 0.61)
  Top 0.254: B02.M2 364.27,174.23 366.3,174.23 368.34,172.2 369.35,172.2 369.35,168.64 B02.P1 369.86,167.63 369.86,163.56 368.34,163.56 365.8,161.02 364.78,161.02 363.26,159.5 360.72,159.5 B02.T2 359.7,158.48 v358.18,158.48 | B02.J1 366.3,184.39 365.29,185.41 360.72,185.41 360.72,189.98 B02.F2 360.72,191 363.76,191 364.78,192.01 368.34,192.01 368.34,194.55 v369.35,195.57 | v358.18,148.32 357.67,148.83 298.74,148.83 296.71,146.8 275.88,146.8 274.36,148.32 248.96,148.32 248.45,147.82 246.92,147.82 246.92,149.34 247.43,149.85 250.48,149.85 252,151.37 B10.V2
  Bottom 0.254: B02.M2 363.76,175.25 364.27,175.76 364.27,178.8 366.3,180.84 366.3,183.88 B02.J1 | v369.35,195.57 369.35,199.63 B02.C1 | v358.18,148.32 358.68,148.83 358.68,157.98 v358.18,158.48
!BAC_00  (via drill 0.61)
  Top 0.254: v257.08,38.6 255.05,36.56 251.5,36.56 249.97,38.09 248.45,38.09 243.88,33.52 233.21,33.52 232.7,33.01 226.1,33.01 v225.08,31.99 | v223.56,11.16 223.05,10.66 205.27,10.66 204.25,11.67 190.03,11.67 189.01,10.66 132.62,10.66 131.61,11.67 124.5,11.67 122.97,13.2 93,13.2 v92.49,13.7 | v97.06,233.16 97.57,233.67 v112.3,233.67 | v114.34,288.02 115.35,289.04 139.74,289.04 141.77,291.07 159.55,291.07 160.06,290.56 161.07,290.56 162.09,289.55 208.32,289.55 215.43,296.66 240.32,296.66 242.35,294.63 292.64,294.63 293.15,295.14 295.69,295.14 v296.2,295.64 | v304.84,206.24 306.87,204.2 v308.9,204.2 | v309.92,201.66 313.98,201.66 315.5,203.19 315.5,204.71 | 315.5,204.71 315.5,205.73 B06.A1 | v353.6,146.8 353.1,146.29 341.41,146.29 340.4,147.31 338.36,147.31 v337.86,146.8 | v338.36,153.91 338.87,153.91 339.38,154.42 339.38,156.96 335.82,156.96 v335.32,156.45 | v337.86,164.07 v335.32,161.53 | v342.94,179.31 339.89,179.31 338.87,178.3 v338.36,178.3 | v327.19,203.19 327.19,204.71 315.5,204.71
  Route2 0.254: v337.86,164.07 337.86,165.6 336.84,166.61 336.84,170.17 339.89,173.22 340.4,173.22 v341.41,174.23
  Route15 0.254: v332.27,189.98 v337.86,184.39 | v332.27,193.54 327.19,198.62 v327.19,203.19
  Bottom 0.254: v257.08,38.6 257.59,39.1 257.59,55.36 258.61,56.38 D10.F1 | v225.08,31.99 223.05,29.96 223.05,21.83 223.56,21.32 v223.56,11.16 | v92.49,13.7 92.49,189.98 95.54,193.03 95.54,231.64 v97.06,233.16 | v112.3,233.67 114.34,235.7 114.34,257.54 113.32,258.56 113.32,260.08 114.84,261.61 114.84,279.9 114.34,280.4 v114.34,288.02 | v296.2,295.64 301.79,290.06 301.79,221.98 302.8,220.97 302.8,217.41 305.34,214.87 305.34,206.74 v304.84,206.24 | v308.9,204.2 309.92,203.19 v309.92,201.66 | v353.6,146.8 353.6,140.2 C03.B1 | v337.86,146.8 337.86,153.4 v338.36,153.91 | v335.32,156.45 333.79,156.45 333.79,160.01 v335.32,161.53 | v341.41,174.23 342.43,175.25 342.43,176.77 342.94,177.28 v342.94,179.31 | v338.36,178.3 338.87,178.8 338.87,179.31 339.38,179.82 339.38,182.87 v337.86,184.39 | v332.27,193.54 v332.27,189.98
!BAC_01  (via drill 0.61)
  Top 0.254: v260.64,62.98 261.15,62.47 264.2,62.47 264.7,61.96 266.74,61.96 v268.77,64 | v273.34,70.6 273.85,71.11 v284.01,71.11 | v290.61,76.19 291.63,77.2 296.2,77.2 296.71,76.7 v308.39,76.7 | v312.46,97.52 312.96,97.02 318.55,97.02 319.57,98.03 320.58,98.03 321.6,97.02 v329.73,97.02 | v330.74,93.97 339.89,93.97 340.4,93.46 356.14,93.46 v356.65,93.97 | v318.04,193.54 317.03,194.55 315,194.55 313.47,196.08 B06.D1
  Route2 0.254: v271.82,67.04 v268.77,64 | v312.46,97.52 v306.87,91.94 | v318.04,193.54 325.66,185.92 328.2,188.46 329.22,188.46 331.76,191 333.28,191 337.35,195.06 338.87,195.06 v340.9,193.03 | v379.51,169.15 382.56,166.1 381.04,164.58 381.04,163.06 371.89,153.91 371.89,149.34 371.38,148.83 371.38,141.72 364.78,135.12 363.76,135.12 362.24,133.59 362.24,132.58 361.73,132.07 359.19,132.07 357.67,130.54 C03.E1
  Route15 0.254: v358.18,108.19 364.78,114.8 364.78,119.88 359.19,125.46 359.19,128 357.67,129.53 C03.E1 | v340.9,193.03 341.92,193.03 345.48,196.58 346.49,195.57 352.59,195.57 354.62,193.54 355.13,193.54 366.3,182.36 366.3,180.33 372.91,173.72 374.94,173.72 v379.51,169.15
  Bottom 0.254: v260.64,62.98 260.64,55.36 261.66,54.34 D10.H1 | v271.82,67.04 273.34,68.57 v273.34,70.6 | v284.01,71.11 285.53,71.11 285.53,71.62 288.07,71.62 288.07,73.65 v290.61,76.19 | v308.39,76.7 308.9,77.2 308.9,88.38 306.87,90.41 v306.87,91.94 | v329.73,97.02 330.74,96 v330.74,93.97 | v356.65,93.97 358.68,96 358.68,105.65 358.18,106.16 v358.18,108.19
!BAC_02  (via drill 0.61)
  Top 0.254: v273.85,31.99 274.36,31.48 278.93,31.48 279.94,30.47 281.98,30.47 285.53,34.02 v287.06,34.02 | v290.61,37.58 292.64,39.61 294.17,39.61 296.71,37.07 297.72,37.07 298.74,38.09 298.74,42.66 308.39,42.66 v308.9,43.17 | v324.65,53.33 325.66,54.34 326.17,54.34 329.73,57.9 333.28,57.9 334.3,58.92 334.81,58.92 336.33,60.44 v336.33,60.95 | v350.56,76.7 352.59,78.73 352.59,81.78 v355.64,81.78 | v352.59,125.97 354.62,123.94 356.65,123.94 C03.H1 | v350.56,115.81 352.08,115.81 v354.11,117.84
  Route2 0.254: v287.06,34.02 v290.61,37.58 | v309.92,45.2 311.95,47.23 313.47,47.23 315.5,49.26 320.58,49.26 v324.65,53.33 | v336.33,60.95 339.38,64 339.89,64 340.4,64.5 340.4,66.54 v350.56,76.7
  Route15 0.254: v262.67,38.09 263.18,38.09 267.75,33.52 272.32,33.52 v273.85,31.99 | v355.64,88.89 355.64,90.41 354.62,91.43 354.62,91.94 352.59,93.97 352.59,97.52 v353.1,98.03 | v313.47,179.31 313.98,178.8 313.98,174.74 314.49,174.23 314.49,165.09 320.58,158.99 320.58,149.34 324.14,145.78 324.14,138.67 330.74,132.07 332.27,132.07 347.51,116.83 349.03,116.83 350.05,115.81 v350.56,115.81
  Bottom 0.254: v262.67,38.09 260.64,40.12 260.64,48.76 259.12,50.28 D10.J1 | v308.9,43.17 309.92,44.18 v309.92,45.2 | v355.64,81.78 v355.64,88.89 | v353.1,98.03 352.59,98.54 352.59,117.84 | 352.59,117.84 v352.59,125.97 | v313.47,179.31 313.98,179.82 313.98,184.9 312.46,186.42 312.46,189.47 B06.F1 | 352.59,117.84 v354.11,117.84
!BAC_03  (via drill 0.61)
  Top 0.254: v254.54,44.18 256.58,44.18 256.58,46.22 258.1,47.74 261.66,47.74 D10.K1 | v257.59,12.18 258.1,12.69 275.88,12.69 276.39,13.2 277.4,13.2 278.42,12.18 332.78,12.18 v333.28,11.67 | v333.28,60.95 332.78,61.46 v329.73,61.46 | v315.5,183.38 313.47,183.38 B06.J1
  Route2 0.254: v329.73,70.6 329.73,78.73 v334.81,83.81 | v336.84,90.92 336.84,93.46 346.49,103.11 348.02,103.11 348.52,103.62 348.52,104.64 v357.67,113.78 | v363.26,125.97 359.19,121.91 359.19,119.37 357.67,117.84 C03.K1
  Route15 0.254: v254.54,44.18 254.54,42.66 v254.04,42.15 | v315.5,183.38 323.63,175.25 323.63,171.18 324.14,170.68 324.14,169.66 331.25,162.55 333.28,162.55 334.3,161.53 334.3,161.02 334.81,160.52 335.82,160.52 v363.26,133.08
  Bottom 0.254: v254.04,42.15 254.04,38.6 257.08,35.55 257.08,21.83 257.59,21.32 v257.59,12.18 | v333.28,11.67 332.78,12.18 332.78,60.44 v333.28,60.95 | v329.73,61.46 v329.73,70.6 | v334.81,83.81 335.32,84.32 335.32,86.86 336.84,88.38 v336.84,90.92 | v357.67,113.78 357.67,116.83 C03.K1 | v363.26,133.08 364.78,131.56 364.78,127.5 v363.26,125.97
!BAC_04  (via drill 0.61)
  Top 0.254: v276.9,12.18 277.4,11.67 331.76,11.67 332.78,10.66 384.59,10.66 v389.67,15.74 | v387.64,53.84 v390.69,53.84 | v387.64,65.52 387.13,65.01 382.56,65.01 382.05,65.52 380.02,65.52 v379,66.54 | v372.91,78.22 371.89,79.24 v366.3,79.24 | v330.74,177.28 327.19,177.28 327.19,178.3 326.68,178.8 318.04,178.8 317.54,178.3 313.98,178.3 313.47,177.79 B06.L1
  Route2 0.254: v351.06,158.48 351.06,157.98 346.49,153.4 346.49,149.85 345.48,148.83 345.48,145.78 339.89,140.2 v339.89,137.66
  Route15 0.254: v258.61,42.15 v255.56,45.2 | v262.16,31.99 264.7,34.53 v270.29,28.94 | v372.91,72.63 v379,66.54 | v366.3,84.82 366.3,85.33 364.27,87.36 364.27,88.89 362.24,90.92 362.24,96 358.68,99.56 358.68,100.57 355.64,103.62 355.64,109.72 356.65,110.73 C03.M1 357.16,111.75 355.64,113.27 355.64,114.8 349.54,120.89 349.54,122.92 349.03,123.43 348.52,123.43 v338.87,133.08 | v330.74,177.28 331.76,177.28 338.87,170.17 339.89,170.17 351.06,158.99 v351.06,158.48
  Bottom 0.254: v255.56,45.2 255.56,47.23 D10.K2 | v258.61,42.15 259.62,41.14 259.62,39.61 260.64,38.6 260.64,33.52 v262.16,31.99 | v270.29,28.94 276.39,22.85 277.4,22.85 277.4,12.69 v276.9,12.18 | v389.67,15.74 390.69,16.75 390.69,51.3 391.2,51.8 391.2,53.33 v390.69,53.84 | v387.64,53.84 387.13,54.34 387.13,65.01 v387.64,65.52 | v372.91,78.22 v372.91,72.63 | v366.3,84.82 v366.3,79.24 | v339.89,137.66 339.89,135.12 338.87,134.1 v338.87,133.08
!BAC_05  (via drill 0.61)
  Top 0.254: v331.76,167.63 329.73,169.66 324.65,169.66 324.14,170.17 324.14,174.74 323.12,175.76 320.58,175.76 320.58,173.72 320.08,173.22 319.06,173.22 318.04,172.2 314.49,172.2 313.47,171.18 B06.N1 | v360.21,156.45 360.72,156.96 363.26,156.96 v363.76,157.47 | v372.4,112.26 371.89,112.76 365.29,112.76 362.75,115.3 361.73,115.3 361.22,115.81 v356.65,115.81
  Route15 0.254: v331.76,167.63 331.76,167.12 332.78,166.1 332.78,165.09 335.32,162.55 335.82,162.55 336.84,161.53 336.84,161.02 337.35,160.52 342.43,160.52 350.05,152.9 352.08,152.9 357.16,157.98 357.67,157.47 359.19,157.47 v360.21,156.45 | v363.76,157.47 372.4,148.83 v372.4,148.32
  Bottom 0.254: v372.4,148.32 371.89,147.82 371.89,112.76 v372.4,112.26 | v356.65,115.81 356.65,113.27 357.16,112.76 358.68,112.76 358.68,110.22 357.16,108.7 357.16,105.14 C03.P1
!BAC_06  (via drill 0.61)
  Top 0.254: v360.21,105.65 360.72,106.16 366.3,106.16 v366.81,105.65 | v369.35,107.68 370.88,109.21 382.56,109.21 383.07,108.7 384.08,108.7 389.16,113.78 389.16,118.35 390.69,118.35 391.2,118.86 391.2,121.4 381.04,121.4 380.53,121.91 370.37,121.91 367.83,119.37 v363.76,119.37 | v347.51,136.13 v344.46,139.18
  Route2 0.254: v360.21,105.65 v357.67,103.11 | v366.81,105.65 367.32,105.65 v369.35,107.68 | v319.06,162.55 317.54,162.55 314.49,165.6 313.47,164.58 B06.R1
  Route15 0.254: v363.76,119.37 363.76,119.88 357.16,126.48 356.14,126.48 355.64,126.99 355.64,129.02 354.62,130.04 353.6,130.04 v347.51,136.13 | v344.46,139.18 339.38,144.26 337.35,144.26 v319.06,162.55
  Bottom 0.254: v357.67,103.11 357.67,99.05 C03.S1
!BAC_07  (via drill 0.61)
  Top 0.254: v316.52,151.88 313.47,151.88 B06.V1 | v353.6,91.43 354.11,91.94 356.65,91.94 C03.U1
  Route15 0.254: v316.52,144.77 331.25,130.04 331.25,128.51 341.92,117.84 341.92,116.83 339.89,114.8 339.38,115.3 v338.87,115.3 | v338.36,107.68 338.36,107.18 353.6,91.94 v353.6,91.43
  Bottom 0.254: v316.52,144.77 v316.52,151.88 | v338.87,115.3 339.38,114.8 339.38,108.7 v338.36,107.68
!BAC_08  (via drill 0.61)
  Top 0.254: v316.52,196.58 317.03,197.09 317.54,197.09 318.55,198.11 326.17,198.11 v326.68,197.6 | v343.95,185.41 350.56,185.41 v351.06,184.9 | v351.57,134.1 349.03,131.56 349.03,130.04 348.52,129.53 348.52,127.5 348.02,127.5 C03.F2
  Route2 0.254: v343.95,185.41 v340.9,188.46 | v363.26,147.82 363.26,146.8 353.6,137.15 353.6,136.13 v351.57,134.1
  Route15 0.254: v326.68,197.6 331.76,192.52 335.32,192.52 v336.33,191.5 | v351.06,184.9 355.64,180.33 355.64,173.72 363.26,166.1 v363.26,165.6
  Bottom 0.254: v316.52,196.58 316.52,199.12 B06.C1 | v336.33,191.5 339.38,191.5 339.38,189.98 v340.9,188.46 | v363.26,165.6 364.78,164.07 364.78,149.34 v363.26,147.82
!BAC_09  (via drill 0.61)
  Top 0.254: v351.06,153.91 351.57,153.91 352.08,154.42 352.08,156.96 v347.51,156.96
  Route2 0.254: v341.92,131.56 342.94,132.58 342.94,139.18 345.98,142.23 345.98,148.32 351.06,153.4 v351.06,153.91 | v328.2,178.3 312.96,193.54 309.92,193.54 B06.E2
  Route15 0.254: v341.41,129.02 347.51,122.92 347.51,121.4 C03.J2 | v347.51,156.96 347,156.96 341.92,162.04 341.92,162.55 338.87,165.6 338.36,165.6 336.33,167.63 334.81,167.63 332.78,169.66 332.78,173.72 v328.2,178.3
  Bottom 0.254: v341.41,129.02 341.92,129.53 v341.92,131.56
!BAC_10  (via drill 0.61)
  Top 0.254: v254.04,261.1 254.54,261.61 275.37,261.61 v275.88,261.1 | v274.36,217.92 279.44,212.84 279.44,209.28 v282.99,209.28 | v306.36,187.44 308.9,187.44 B06.H2 | v289.6,196.08 292.64,199.12 v294.17,199.12
  Route2 0.254: v314.49,83.3 315.5,84.32 318.04,84.32 318.55,84.82 327.19,84.82 336.33,93.97 336.33,94.48 347,105.14 347.51,105.14 349.54,107.18 349.54,112.26 348.02,113.78 C03.L2 | v271.82,98.03 274.86,101.08 275.37,101.08 275.88,101.59 275.88,105.65 276.39,106.16 276.39,108.7 279.94,112.26 281.98,112.26 285.02,115.3 285.02,115.81 288.58,119.37 288.58,121.91 289.09,122.42 291.12,122.42 292.14,123.43 292.14,124.45 287.56,129.02 287.06,128.51 286.55,128.51 v284.52,126.48 | v274.36,177.79 276.39,179.82 276.39,181.34 282.99,187.95 282.99,189.47 283.5,189.98 285.02,189.98 288.58,193.54 288.58,195.06 v289.6,196.08
  Route15 0.254: v275.88,249.42 v273.34,246.88 | v282.99,209.28 283.5,209.28 293.66,199.12 | 293.66,199.12 295.18,197.6 295.18,197.09 296.71,195.57 298.23,195.57 v306.36,187.44 | v314.49,83.3 306.36,83.3 305.85,83.81 304.84,83.81 303.31,85.33 292.64,85.33 288.58,89.4 288.58,89.9 288.07,90.41 284.52,90.41 282.99,88.89 281.98,89.9 281.98,91.94 277.4,96.51 277.4,98.03 275.37,100.06 273.85,100.06 v271.82,98.03 | v284.52,126.48 284.52,127.5 282.99,129.02 282.99,135.12 279.44,138.67 279.44,142.74 275.37,146.8 275.37,150.86 274.86,151.37 274.86,152.9 273.34,154.42 273.34,176.77 v274.36,177.79 | 293.66,199.12 v294.17,199.12
  Bottom 0.254: v254.04,261.1 253.53,261.61 253.53,265.67 253.02,266.18 A10.D2 | v275.88,261.1 276.39,260.59 276.39,249.92 v275.88,249.42 | v273.34,246.88 273.34,243.32 276.9,239.76 276.9,224.52 274.36,221.98 v274.36,217.92
!BAC_11  (via drill 0.61)
  Top 0.254: v246.42,81.78 v262.16,81.78 | v289.09,76.19 294.17,81.27 311.44,81.27 313.47,79.24 313.47,78.22 315,78.22 317.54,80.76 v317.54,85.33 | v305.85,180.84 308.9,180.84 B06.K2 | v289.6,118.86 v289.6,121.4
  Route2 0.254: v262.16,81.78 265.21,81.78 268.26,84.82 270.29,84.82 | 270.29,84.82 274.86,84.82 v275.37,85.33 | v321.09,88.38 324.14,85.33 331.76,92.95 331.76,94.48 343.44,106.16 345.48,106.16 347,107.68 C03.N2 | v294.17,192.01 293.66,192.52 292.14,191 292.14,184.39 286.04,178.3 286.04,177.79 284.01,175.76 283.5,175.76 282.99,175.25 282.99,174.23 281.47,172.71 280.45,172.71 279.44,171.69 279.44,168.64 v274.86,164.07 | v289.6,118.86 289.09,118.35 289.09,113.78 287.06,111.75 287.06,110.22 279.44,102.6 279.44,99.56 273.34,93.46 273.34,92.44 271.31,90.41 270.8,90.41 270.29,89.9 270.29,84.82
  Route15 0.254: v240.32,91.43 240.32,90.41 241.34,89.4 241.34,87.87 243.37,85.84 243.37,84.82 v246.42,81.78 | v275.37,85.33 275.88,85.33 284.01,77.2 288.07,77.2 v289.09,76.19 | v305.85,180.84 305.34,180.84 302.3,183.88 301.79,183.88 301.28,184.39 301.28,184.9 v294.17,192.01 | v274.86,164.07 274.86,163.56 275.88,162.55 275.88,153.4 276.9,152.39 276.9,148.83 277.4,148.32 277.4,145.78 285.53,137.66 285.53,133.08 286.04,132.58 286.04,124.96 v289.6,121.4
  Bottom 0.254: v240.32,91.43 240.32,92.95 241.34,93.97 241.34,96 239.3,98.03 239.3,101.08 C11.R2 | v317.54,85.33 320.58,88.38 v321.09,88.38
!BLK_IN_SYNC  (via drill 0.61)
  Top 0.254: v221.52,101.08 217.97,101.08 C13.R1 | v232.7,92.44 233.21,92.95 235.24,92.95 235.75,93.46 240.32,93.46 v241.34,92.44 | v241.34,72.12 241.84,71.62 249.46,71.62 v249.97,71.11 | v249.97,50.79 D10.J2 | v258.61,276.34 261.66,276.34 A10.A1 | v222.54,272.78 221.52,271.77 171.23,271.77 170.22,270.75 v168.18,270.75 | v167.68,164.58 170.72,161.53 v171.74,161.53 | v212.89,110.22 213.4,109.72 214.92,109.72 215.94,110.73 v215.94,111.24
  Route15 0.254: v221.52,101.08 222.03,101.08 222.54,100.57 223.56,100.57 226.1,98.03 227.11,98.03 v232.7,92.44 | v258.61,276.34 257.59,276.34 256.07,277.86 250.48,277.86 243.37,284.98 240.32,284.98 237.78,287.52 232.7,287.52 222.54,277.36 v222.54,276.85 | v177.33,151.88 177.33,144.26 177.84,143.75 177.84,141.72 175.3,139.18 176.31,138.16 177.84,138.16 185.46,130.54 186.47,130.54 189.52,127.5 189.52,125.46 197.65,117.34 199.68,117.34 204.25,112.76 210.35,112.76 v212.89,110.22
  Bottom 0.254: v241.34,92.44 241.34,82.28 241.84,81.78 241.84,74.16 241.34,73.65 v241.34,72.12 | v249.97,71.11 250.48,70.6 250.48,51.3 v249.97,50.79 | v222.54,276.85 v222.54,272.78 | v168.18,270.75 168.18,266.18 167.68,265.67 167.68,264.66 168.18,264.15 168.18,223.51 166.66,221.98 166.66,220.97 167.68,219.95 167.68,209.28 165.14,206.74 165.14,180.33 167.17,178.3 168.18,178.3 168.18,165.09 v167.68,164.58 | v171.74,161.53 171.74,157.47 v177.33,151.88 | v215.94,111.24 218.48,111.24 218.48,109.21 218.98,108.7 218.98,107.18 217.97,106.16 217.97,102.1 C13.R1
!BMB_00
  Top 0.254: C06.A1 316.52,143.24 320.08,143.24 321.6,144.77 376.97,144.77 377.99,143.75 377.99,141.21 372.4,141.21 371.38,140.2 367.32,140.2 C02.B1
!BMB_01  (via drill 0.61)
  Top 0.254: v319.57,135.12 318.55,135.12 317.03,133.59 313.47,133.59 C06.D1 | v330.24,129.53 330.74,129.02 v336.84,129.02 | v341.92,136.64 343.44,135.12 367.32,135.12 369.35,133.08 370.37,133.08 370.88,132.58 370.88,130.54 370.37,130.54 C02.E1
  Route15 0.254: v319.57,135.12 v321.6,133.08
  Bottom 0.254: v321.6,133.08 324.65,130.04 324.65,129.53 325.66,128.51 330.24,128.51 v330.24,129.53 | v336.84,129.02 336.84,131.05 337.86,132.07 339.89,132.07 339.89,134.1 341.92,136.13 v341.92,136.64
!BMB_02  (via drill 0.61)
  Top 0.254: v323.12,125.46 318.55,125.46 317.54,126.48 313.98,126.48 313.47,126.99 C06.F1 | v328.71,93.97 329.73,92.95 336.84,92.95 337.35,93.46 339.38,93.46 340.4,92.44 v340.9,92.44 | v343.44,85.33 343.95,85.84 355.13,85.84 355.64,85.33 364.27,85.33 v364.78,84.82 | v365.29,122.92 365.8,123.43 369.35,123.43 C02.H1
  Route15 0.254: v323.12,125.46 323.63,125.46 v325.66,123.43
  Bottom 0.254: v325.66,123.43 327.19,121.91 327.19,106.67 326.68,106.16 326.68,96.51 328.71,94.48 v328.71,93.97 | v340.9,92.44 343.44,89.9 v343.44,85.33 | v364.78,84.82 364.27,85.33 364.27,90.41 364.78,90.92 364.78,99.05 365.29,99.56 v365.29,122.92
!BMB_03  (via drill 0.61)
  Top 0.254: v297.72,112.76 300.77,112.76 301.79,113.78 303.82,113.78 308.9,118.86 311.44,118.86 312.46,119.88 C06.J1 | v296.71,114.8 294.68,112.76 289.6,112.76 v288.07,111.24 | v292.14,76.19 307.38,76.19 307.88,75.68 316.01,75.68 316.52,76.19 320.58,76.19 321.6,75.17 329.22,75.17 330.24,74.16 336.84,74.16 337.35,74.66 v387.13,74.66 | v390.18,119.37 374.94,119.37 373.42,117.84 370.37,117.84 C02.K1